# Altium project 48FE+2GE+2SFP.PrjPcb (part 7 of 9)

## Sheet 30_PP0_PWR.SchDoc
size 419 x 296 mm; Author: Serbinov O.A.; CompanyName: ELSICOM; DrawnBy: Serbinov O.A.; Engineer: Serbinov O.A.; Organization: Elsicom; Address1: Kirova avenue, 58; Address2: Tomsk; Address3: Russia 634012; DocumentNumber: 31; SheetNumber: 31; SheetTotal: 44; ProjectName: 48_PORTS
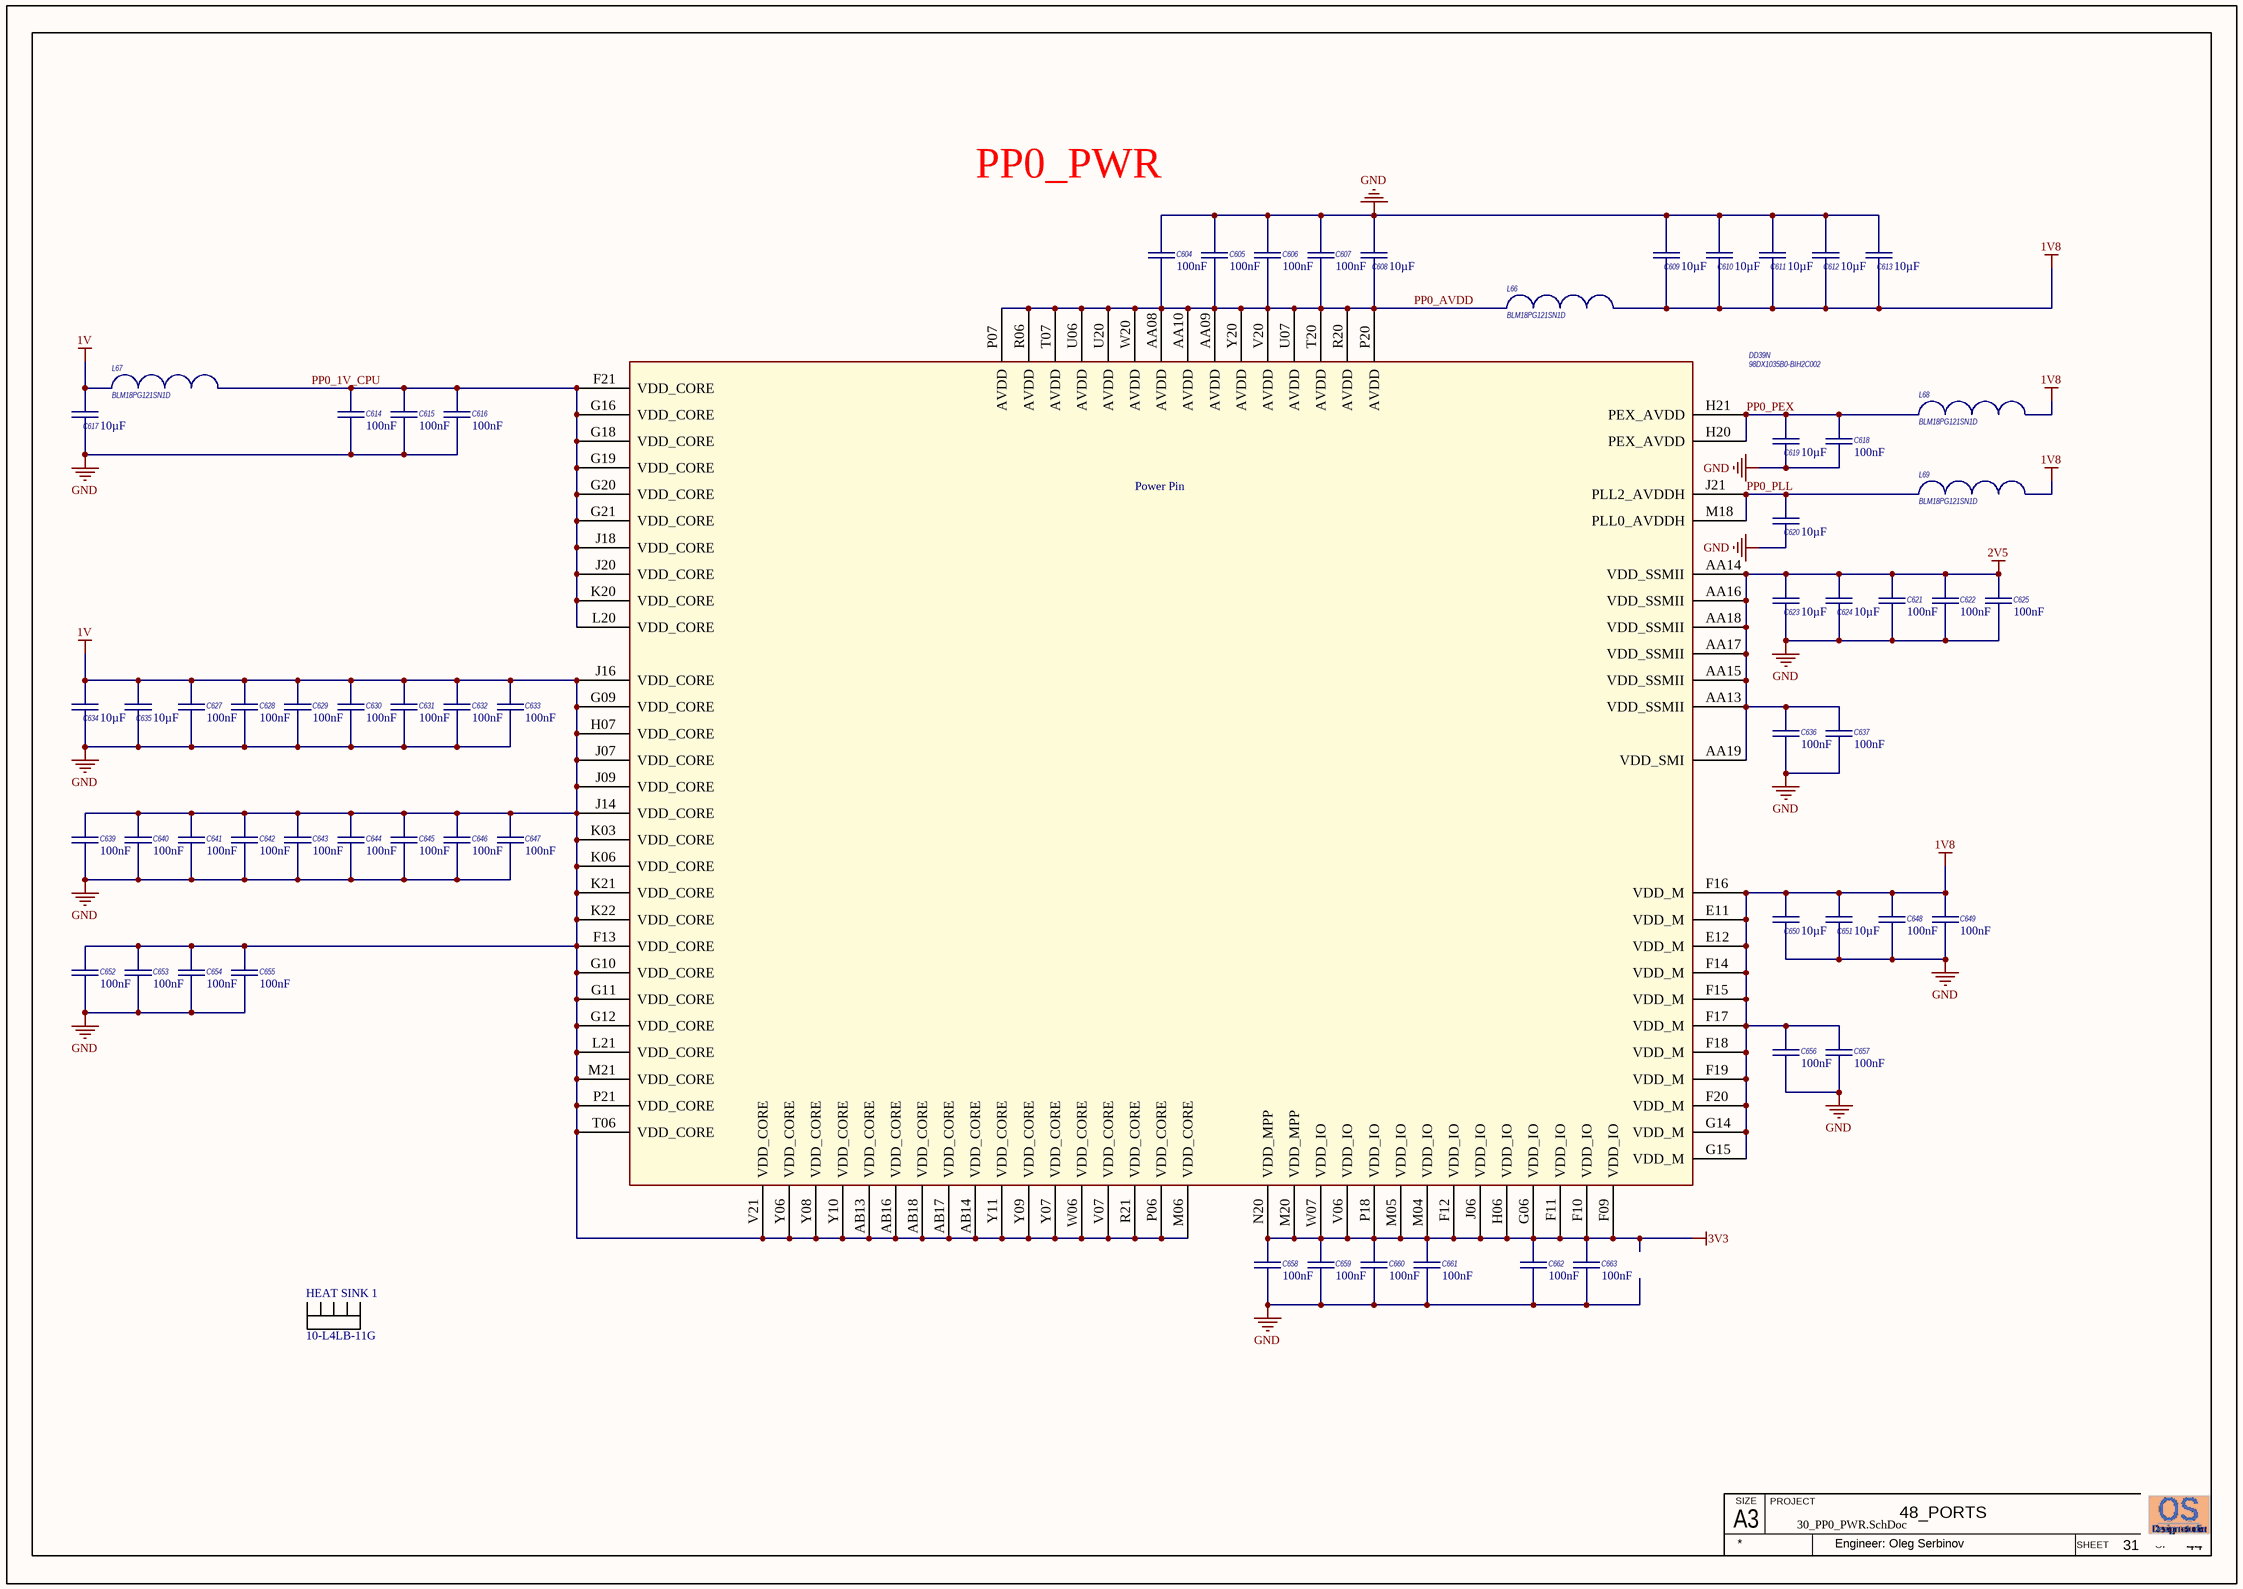
[diagram p17: 30_PP0_PWR.SchDoc]

### Parts
C604  Capacitance: 100nF  [C0402_IPC High Density]  (hidden comment: GRM155R71E104KE14D)
C605  Capacitance: 100nF  [C0402_IPC High Density]  (hidden comment: GRM155R71E104KE14D)
C606  Capacitance: 100nF  [C0402_IPC High Density]  (hidden comment: GRM155R71E104KE14D)
C607  Capacitance: 100nF  [C0402_IPC High Density]  (hidden comment: GRM155R71E104KE14D)
C608  Capacitance: 10µF  [CAPC2012[0805]]  (hidden comment: GRM21BR61C106KE15)
C609  Capacitance: 10µF  [CAPC2012[0805]]  (hidden comment: GRM21BR61C106KE15)
C610  Capacitance: 10µF  [CAPC2012[0805]]  (hidden comment: GRM21BR61C106KE15)
C611  Capacitance: 10µF  [CAPC2012[0805]]  (hidden comment: GRM21BR61C106KE15)
C612  Capacitance: 10µF  [CAPC2012[0805]]  (hidden comment: GRM21BR61C106KE15)
C613  Capacitance: 10µF  [CAPC2012[0805]]  (hidden comment: GRM21BR61C106KE15)
C614  Capacitance: 100nF  [C0402_IPC High Density]  (hidden comment: GRM155R71E104KE14D)
C615  Capacitance: 100nF  [C0402_IPC High Density]  (hidden comment: GRM155R71E104KE14D)
C616  Capacitance: 100nF  [C0402_IPC High Density]  (hidden comment: GRM155R71E104KE14D)
C617  Capacitance: 10µF  [CAPC2012[0805]]  (hidden comment: GRM21BR61C106KE15)
C618  Capacitance: 100nF  [C0402_IPC High Density]  (hidden comment: GRM155R71E104KE14D)
C619  Capacitance: 10µF  [CAPC2012[0805]]  (hidden comment: GRM21BR61C106KE15)
C620  Capacitance: 10µF  [CAPC2012[0805]]  (hidden comment: GRM21BR61C106KE15)
C621  Capacitance: 100nF  [C0402_IPC High Density]  (hidden comment: GRM155R71E104KE14D)
C622  Capacitance: 100nF  [C0402_IPC High Density]  (hidden comment: GRM155R71E104KE14D)
C623  Capacitance: 10µF  [CAPC2012[0805]]  (hidden comment: GRM21BR61C106KE15)
C624  Capacitance: 10µF  [CAPC2012[0805]]  (hidden comment: GRM21BR61C106KE15)
C625  Capacitance: 100nF  [C0402_IPC High Density]  (hidden comment: GRM155R71E104KE14D)
C627  Capacitance: 100nF  [C0402_IPC High Density]  (hidden comment: GRM155R71E104KE14D)
C628  Capacitance: 100nF  [C0402_IPC High Density]  (hidden comment: GRM155R71E104KE14D)
C629  Capacitance: 100nF  [C0402_IPC High Density]  (hidden comment: GRM155R71E104KE14D)
C630  Capacitance: 100nF  [C0402_IPC High Density]  (hidden comment: GRM155R71E104KE14D)
C631  Capacitance: 100nF  [C0402_IPC High Density]  (hidden comment: GRM155R71E104KE14D)
C632  Capacitance: 100nF  [C0402_IPC High Density]  (hidden comment: GRM155R71E104KE14D)
C633  Capacitance: 100nF  [C0402_IPC High Density]  (hidden comment: GRM155R71E104KE14D)
C634  Capacitance: 10µF  [CAPC2012[0805]]  (hidden comment: GRM21BR61C106KE15)
C635  Capacitance: 10µF  [CAPC2012[0805]]  (hidden comment: GRM21BR61C106KE15)
C636  Capacitance: 100nF  [C0402_IPC High Density]  (hidden comment: GRM155R71E104KE14D)
C637  Capacitance: 100nF  [C0402_IPC High Density]  (hidden comment: GRM155R71E104KE14D)
C639  Capacitance: 100nF  [C0402_IPC High Density]  (hidden comment: GRM155R71E104KE14D)
C640  Capacitance: 100nF  [C0402_IPC High Density]  (hidden comment: GRM155R71E104KE14D)
C641  Capacitance: 100nF  [C0402_IPC High Density]  (hidden comment: GRM155R71E104KE14D)
C642  Capacitance: 100nF  [C0402_IPC High Density]  (hidden comment: GRM155R71E104KE14D)
C643  Capacitance: 100nF  [C0402_IPC High Density]  (hidden comment: GRM155R71E104KE14D)
C644  Capacitance: 100nF  [C0402_IPC High Density]  (hidden comment: GRM155R71E104KE14D)
C645  Capacitance: 100nF  [C0402_IPC High Density]  (hidden comment: GRM155R71E104KE14D)
C646  Capacitance: 100nF  [C0402_IPC High Density]  (hidden comment: GRM155R71E104KE14D)
C647  Capacitance: 100nF  [C0402_IPC High Density]  (hidden comment: GRM155R71E104KE14D)
C648  Capacitance: 100nF  [C0402_IPC High Density]  (hidden comment: GRM155R71E104KE14D)
C649  Capacitance: 100nF  [C0402_IPC High Density]  (hidden comment: GRM155R71E104KE14D)
C650  Capacitance: 10µF  [CAPC2012[0805]]  (hidden comment: GRM21BR61C106KE15)
C651  Capacitance: 10µF  [CAPC2012[0805]]  (hidden comment: GRM21BR61C106KE15)
C652  Capacitance: 100nF  [C0402_IPC High Density]  (hidden comment: GRM155R71E104KE14D)
C653  Capacitance: 100nF  [C0402_IPC High Density]  (hidden comment: GRM155R71E104KE14D)
C654  Capacitance: 100nF  [C0402_IPC High Density]  (hidden comment: GRM155R71E104KE14D)
C655  Capacitance: 100nF  [C0402_IPC High Density]  (hidden comment: GRM155R71E104KE14D)
C656  Capacitance: 100nF  [C0402_IPC High Density]  (hidden comment: GRM155R71E104KE14D)
C657  Capacitance: 100nF  [C0402_IPC High Density]  (hidden comment: GRM155R71E104KE14D)
C658  Capacitance: 100nF  [C0402_IPC High Density]  (hidden comment: GRM155R71E104KE14D)
C659  Capacitance: 100nF  [C0402_IPC High Density]  (hidden comment: GRM155R71E104KE14D)
C660  Capacitance: 100nF  [C0402_IPC High Density]  (hidden comment: GRM155R71E104KE14D)
C661  Capacitance: 100nF  [C0402_IPC High Density]  (hidden comment: GRM155R71E104KE14D)
C662  Capacitance: 100nF  [C0402_IPC High Density]  (hidden comment: GRM155R71E104KE14D)
C663  Capacitance: 100nF  [C0402_IPC High Density]  (hidden comment: GRM155R71E104KE14D)
DD39  98DX1035B0-BIH2C002  [HSBGA617_27X27_1MM]  (part N of 16)
HEAT_SINK_1  10-L4LB-11G  [10-L4LB-11G]  (no BOM)
L66  BLM18PG121SN1D  [INDC1608X95N]
L67  BLM18PG121SN1D  [INDC1608X95N]
L68  BLM18PG121SN1D  [INDC1608X95N]
L69  BLM18PG121SN1D  [INDC1608X95N]

### Nets
1V: C617.2 C627.1 C628.1 C629.1 C630.1 C631.1 C632.1 C633.1 C634.2 C635.2 C639.1 C640.1 C641.1 C642.1 C643.1 C644.1 C645.1 C646.1 C647.1 C652.1 C653.1 C654.1 C655.1 DD39.AB13(VDD_CORE) DD39.AB14(VDD_CORE) DD39.AB16(VDD_CORE) DD39.AB17(VDD_CORE) DD39.AB18(VDD_CORE) DD39.F13(VDD_CORE) DD39.G09(VDD_CORE) DD39.G10(VDD_CORE) DD39.G11(VDD_CORE) DD39.G12(VDD_CORE) DD39.H07(VDD_CORE) DD39.J07(VDD_CORE) DD39.J09(VDD_CORE) DD39.J14(VDD_CORE) DD39.J16(VDD_CORE) DD39.K03(VDD_CORE) DD39.K06(VDD_CORE) DD39.K21(VDD_CORE) DD39.K22(VDD_CORE) DD39.L21(VDD_CORE) DD39.M06(VDD_CORE) DD39.M21(VDD_CORE) DD39.P06(VDD_CORE) DD39.P21(VDD_CORE) DD39.R21(VDD_CORE) DD39.T06(VDD_CORE) DD39.V07(VDD_CORE) DD39.V21(VDD_CORE) DD39.W06(VDD_CORE) DD39.Y06(VDD_CORE) DD39.Y07(VDD_CORE) DD39.Y08(VDD_CORE) DD39.Y09(VDD_CORE) DD39.Y10(VDD_CORE) DD39.Y11(VDD_CORE) L67.1
1V8: C609.1 C610.1 C611.1 C612.1 C613.1 C648.1 C649.1 C650.2 C651.2 C656.1 C657.1 DD39.E11(VDD_M) DD39.E12(VDD_M) DD39.F14(VDD_M) DD39.F15(VDD_M) DD39.F16(VDD_M) DD39.F17(VDD_M) DD39.F18(VDD_M) DD39.F19(VDD_M) DD39.F20(VDD_M) DD39.G14(VDD_M) DD39.G15(VDD_M) L66.2 L68.2 L69.2
2V5: C621.1 C622.1 C623.2 C624.2 C625.1 C636.1 C637.1 DD39.AA13(VDD_SSMII) DD39.AA14(VDD_SSMII) DD39.AA15(VDD_SSMII) DD39.AA16(VDD_SSMII) DD39.AA17(VDD_SSMII) DD39.AA18(VDD_SSMII) DD39.AA19(VDD_SMI)
3V3: C658.1 C659.1 C660.1 C661.1 C662.1 C663.1 DD39.F09(VDD_IO) DD39.F10(VDD_IO) DD39.F11(VDD_IO) DD39.F12(VDD_IO) DD39.G06(VDD_IO) DD39.H06(VDD_IO) DD39.J06(VDD_IO) DD39.M04(VDD_IO) DD39.M05(VDD_IO) DD39.M20(VDD_MPP) DD39.N20(VDD_MPP) DD39.P18(VDD_IO) DD39.V06(VDD_IO) DD39.W07(VDD_IO)
GND: C604.1 C605.1 C606.1 C607.1 C608.2 C609.2 C610.2 C611.2 C612.2 C613.2 C614.2 C615.2 C616.2 C617.1 C618.2 C619.1 C620.1 C621.2 C622.2 C623.1 C624.1 C625.2 C627.2 C628.2 C629.2 C630.2 C631.2 C632.2 C633.2 C634.1 C635.1 C636.2 C637.2 C639.2 C640.2 C641.2 C642.2 C643.2 C644.2 C645.2 C646.2 C647.2 C648.2 C649.2 C650.1 C651.1 C652.2 C653.2 C654.2 C655.2 C656.2 C657.2 C658.2 C659.2 C660.2 C661.2 C662.2 C663.2
PP0_1V_CPU: C614.1 C615.1 C616.1 DD39.F21(VDD_CORE) DD39.G16(VDD_CORE) DD39.G18(VDD_CORE) DD39.G19(VDD_CORE) DD39.G20(VDD_CORE) DD39.G21(VDD_CORE) DD39.J18(VDD_CORE) DD39.J20(VDD_CORE) DD39.K20(VDD_CORE) DD39.L20(VDD_CORE) L67.2
PP0_AVDD: C604.2 C605.2 C606.2 C607.2 C608.1 DD39.AA08(AVDD) DD39.AA09(AVDD) DD39.AA10(AVDD) DD39.P07(AVDD) DD39.P20(AVDD) DD39.R06(AVDD) DD39.R20(AVDD) DD39.T07(AVDD) DD39.T20(AVDD) DD39.U06(AVDD) DD39.U07(AVDD) DD39.U20(AVDD) DD39.V20(AVDD) DD39.W20(AVDD) DD39.Y20(AVDD) L66.1
PP0_PEX: C618.1 C619.2 DD39.H20(PEX_AVDD) DD39.H21(PEX_AVDD) L68.1
PP0_PLL: C620.2 DD39.J21(PLL2_AVDDH) DD39.M18(PLL0_AVDDH) L69.1

### Notes on the sheet
- PP0_PWR
- A3
- SIZE
- PROJECT
- SHEET
- OF
- Engineer: Oleg Serbinov
- (in symbol 98DX1035A1-BIH2C002, part N) Power Pin

### Library data of the parts
C604-C607 C614-C616 C618 C621 C622 C625 C627-C633 C636 C637 C639-C649 C652-C663 = GRM155R71E104KE14D: C0402, 100nF, 25V, X7R; Manufacturer: Murata; Rmanufacturer: Yageo  Samsung  TDK  Taiyo Yuden  Kemet; Customer Part Number: Конденсатор, 100n, 0402, 25V, X7R, 10%; Capacitance Tolerance: ± 10%; Voltage Rating: 16; Capacitor Case Style: 0402 [1005 Metric]; Capacitor Terminals: SMD; SVHC: No SVHC (19-Dec-2012); No. of Pins: 2; Reel Quantity: 10000; Tolerance +: 10%; Analogs: any suitable; Manufacturer Part Number: GRM155R71E104KE14D; RoHS: YES; Packaging: Reel; Package / Case: 0402; ComponentLink1URL: http://www.farnell.com/datasheets/4360.pdf; ComponentLink1Description: http://www.farnell.com/datasheets/4360.pdf; Pricing: 10000=0.008593, 30000=0.007991 (GBP); Supplier 1: Farnell; Supplier Part Number 1: 1118151; Stock: 3; Dielectric Characteristic: X7R; Operating Temperature Min: -55; Operating Temperature Max: 125; Operating Temperature Range: -55°C to +125; Series: GRM Hi-Cap; Terminal Type: Surface Mount (SMD, SMT); Tolerance -: 10%; Voltage Rating V DC: 16
C608-C613 C617 C619 C620 C623 C624 C634 C635 C650 C651 = GRM21BR61C106KE15: C0805, 10uF 10%, 16V, X5R; Manufacturer: Murata; Customer Part Number: Конденсатор, 10u, 0805, 16V, X5R, 10%; Analogs: any suitable; Applications: General Purpose; Category: Capacitors; Operating Temperature: -55°C ~ 85°C; Package / Case: 0805 (2012 Metric); Size / Dimension: 0.079" L x 0.049" W (2.00mm x 1.25mm); Temperature Coefficient: X5R; Tolerance: ±10%; ComponentLink1URL: http://search.murata.co.jp/Ceramy/image/img/PDF/ENG/GRM21BR61C106KE15.pdf; ComponentLink1Description: http://search.murata.co.jp/Ceramy/image/img/PDF/ENG/GRM21BR61C106KE15.pdf; Pricing: 1=0.3, 10=0.25, 50=0.1408, 100=0.1252, 250=0.09392, 500=0.08294, 1000=0.07356 (USD); Voltage - Rated: 16V; Manufacturer Part Number: GRM21BR61C106KE15
DD39 = 98DX1035A1-BIH2C002: IC 24-PORT FE  4-PORT 2.5GE L2 ENTRY-LEVEL, CPU; Customer Part Number: Микросхема, 98DX1035B0-BIH2C002, IC 24-PORT FE 4-PORT 2.5GE L2 ENTRY-LEVEL, HSBGA617SBGA617; Manufacturer: Marvell Technology Group; Manufacturer Part Number: 98DX1035B0-BIH2C002
HEAT_SINK_1 = 10-L4LB-11G: HEAT SINK  45.2x41.4; Manufacturer: Aavid Thermalloy; Customer Part Number: Радиатор, 10-L4LB-11G, Pin Fin heat sink with Push Pin attachment; Manufacturer Part Number: 10-L4LB-11G
L66-L69 = BLM18PG121SN1D: FILTER BLM18 (0603, 2A); Manufacturer: Murata; Rpart number: MPZ1608S121ATAH0 ; CIC10P121NC ; MPZ1608S121ATDH5 ; BLM18PG121SH1D ; 742792625; Rmanufacturer: Boruns  Samsung  TDK  Murata  Wurth Electronics; Customer Part Number: Дроссель, BLM18PG121SN1D, FERRITE BEAD 120 OHM 1LN, 0603; DC Resistance Max: 0.05; Impedance: 120; Ferrite Mounting: SMD; Inductor Type: Ferrite Bead; SVHC: No SVHC (19-Dec-2011); Ferrite Case Style: 0603 / 1608; Core Material: Ferrite; DC Current Max: 2000; Inductor Case Style: 0603; Inductance Tolerance: ± 25%; No. of Pins: 2; RoHS: YES; Operating Temperature Min: -55; Mounting Type: SMD; Operating Temperature Max: +125; Package / Case: 0603; Impedance @ 100MHz Typ: 120; Resistance: 0.05; Supplier Part Number: 1515738; Supplier: Farnell; ComponentLink1URL: http://www.farnell.com/datasheets/5148.pdf; ComponentLink1Description: http://www.farnell.com/datasheets/5148.pdf; Pricing: 5=0.056, 50=0.041, 100=0.034, 250=0.028, 500=0.027 (GBP); Manufacturer Part Number: BLM18PG121SN1D; DC Current Rating: 2A; Analogs: MPZ1608S121ATAH0 ; CIC10P121NC ; MPZ1608S121ATDH5 ; BLM18PG121SH1D ; 742792625

## Sheet 32_PP0_NC.SchDoc
size 419 x 296 mm; Author: Serbinov O.A.; CompanyName: ELSICOM; DrawnBy: Serbinov O.A.; Engineer: Serbinov O.A.; Organization: Elsicom; Address1: Kirova avenue, 58; Address2: Tomsk; Address3: Russia 634012; DocumentNumber: 33; SheetNumber: 33; SheetTotal: 44; ProjectName: 48_PORTS
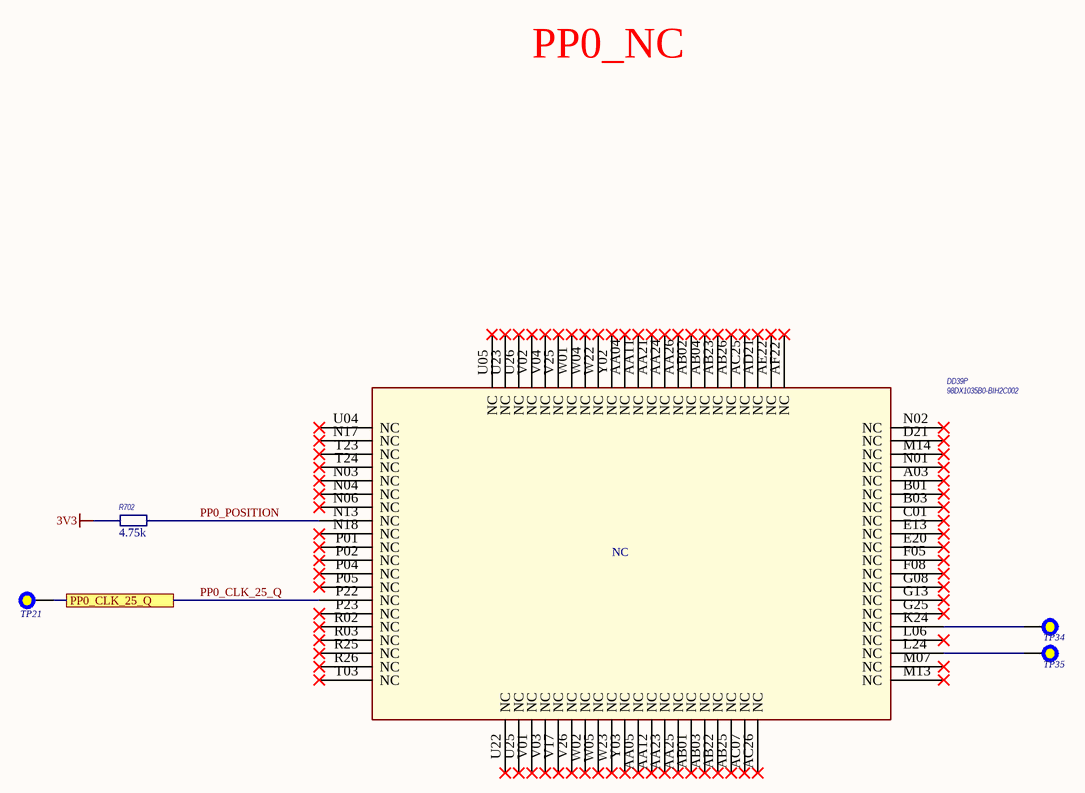
[diagram p18: 32_PP0_NC.SchDoc]

### Parts
DD39  98DX1035B0-BIH2C002  [HSBGA617_27X27_1MM]  (part P of 16)
R702  Resistance (Ohms): 4.75k  [R0402_IPC High Density]  (hidden comment: ERJ-2RKF4751X)
TP21  Test Point 0.5mm pad  [Test Point 0.5mm]  (value not drawn)  (no BOM)
TP34  Test Point 0.5mm pad  [Test Point 0.5mm]  (value not drawn)  (no BOM)
TP35  Test Point 0.5mm pad  [Test Point 0.5mm]  (value not drawn)  (no BOM)

### Ports
PP0_CLK_25_Q

### Nets
3V3: R702.1
PP0_CLK_25_Q: DD39.P22(NC) TP21.1 ; port PP0_CLK_25_Q
PP0_POSITION: DD39.N13(NC) R702.2
NetDD39_K24: DD39.K24(NC) TP34.1
NetDD39_L24: DD39.L24(NC) TP35.1

Not connected (* = marked no-connect by the designer): DD39 A03(NC)* AA04(NC)* AA05(NC)* AA11(NC)* AA12(NC)* AA21(NC)* AA23(NC)* AA24(NC)* AA25(NC)* AA26(NC)* AB01(NC)* AB02(NC)* AB03(NC)* AB04(NC)* AB22(NC)* AB23(NC)* AB25(NC)* AB26(NC)* AC07(NC)* AC25(NC)* AC26(NC)* AD21(NC)* AE22(NC)* AF22(NC)* B01(NC)* B03(NC)* C01(NC)* D21(NC)* E13(NC)* E20(NC)* F05(NC)* F08(NC)* G08(NC)* G13(NC)* G25(NC)* L06(NC)* M07(NC)* M13(NC)* M14(NC)* N01(NC)* N02(NC)* N03(NC)* N04(NC)* N06(NC)* N17(NC)* N18(NC)* P01(NC)* P02(NC)* P04(NC)* P05(NC)* P23(NC)* R02(NC)* R03(NC)* R25(NC)* R26(NC)* T03(NC)* T23(NC)* T24(NC)* U04(NC)* U05(NC)* U22(NC)* U23(NC)* U25(NC)* U26(NC)* V01(NC)* V02(NC)* V03(NC)* V04(NC)* V17(NC)* V25(NC)* V26(NC)* W01(NC)* W02(NC)* W04(NC)* W05(NC)* W22(NC)* W23(NC)* Y02(NC)* Y03(NC)*

### Notes on the sheet
- PP0_NC
- A3
- SIZE
- PROJECT
- SHEET
- OF
- Engineer: Oleg Serbinov

### Library data of the parts
DD39 = 98DX1035A1-BIH2C002: as DD39 on sheet 30_PP0_PWR; Manufacturer Part Number: 98DX1035B0-BIH2C002
R702 = ERJ-2RKF4751X: R0402, 4.75k 1%; Manufacturer: Panasonic; Rpart number: RC0402FR-074K75L ; RC1005F4751CS ; RMCF0402FT4K75 ; CRCW04024K75FKED ; TRR01MZPF4751; Rmanufacturer: Yageo  Samsung  Stackpole Electronics  Rohm Semiconductor  Vishay Dale; Customer Part Number: Резистор, 4K75, 0402, 1%; Temperature Coefficient: ±100ppm/°C; Power (Watts): 0.1W, 1/10W; Analogs: any suitable; Tolerance: ±1%; Packaging: Cut Tape (CT); Package / Case: 0402 (1005 Metric); Category: Resistors; Manufacturer Part Number: ERJ-2RKF4751X; Supplier Part Number: P4.75KLCT-ND; RoHS: RoHS Compliant; Supplier: Digi-Key; ComponentLink1URL: http://industrial.panasonic.com/www-cgi/jvcr13pz.cgi?E+PZ+3+AOA0002+ERJ2RKF4751X+7+WW; ComponentLink1Description: http://industrial.panasonic.com/www-cgi/jvcr13pz.cgi?E+PZ+3+AOA0002+ERJ2RKF4751X+7+WW; Features: -; Composition: Thick Film; Height: 0.016" (0.40mm); Number of Terminations: 2; Supplier Device Package: 0402; Size / Dimension: 0.039" L x 0.020" W (1.00mm x 0.50mm)

## Sheet 33_PP0_CONFIG.SchDoc
size 419 x 296 mm; Author: Serbinov O.A.; CompanyName: ELSICOM; DrawnBy: Serbinov O.A.; Engineer: Serbinov O.A.; Organization: Elsicom; Address1: Kirova avenue, 58; Address2: Tomsk; Address3: Russia 634012; DocumentNumber: 34; SheetNumber: 34; SheetTotal: 44; ProjectName: 48_PORTS
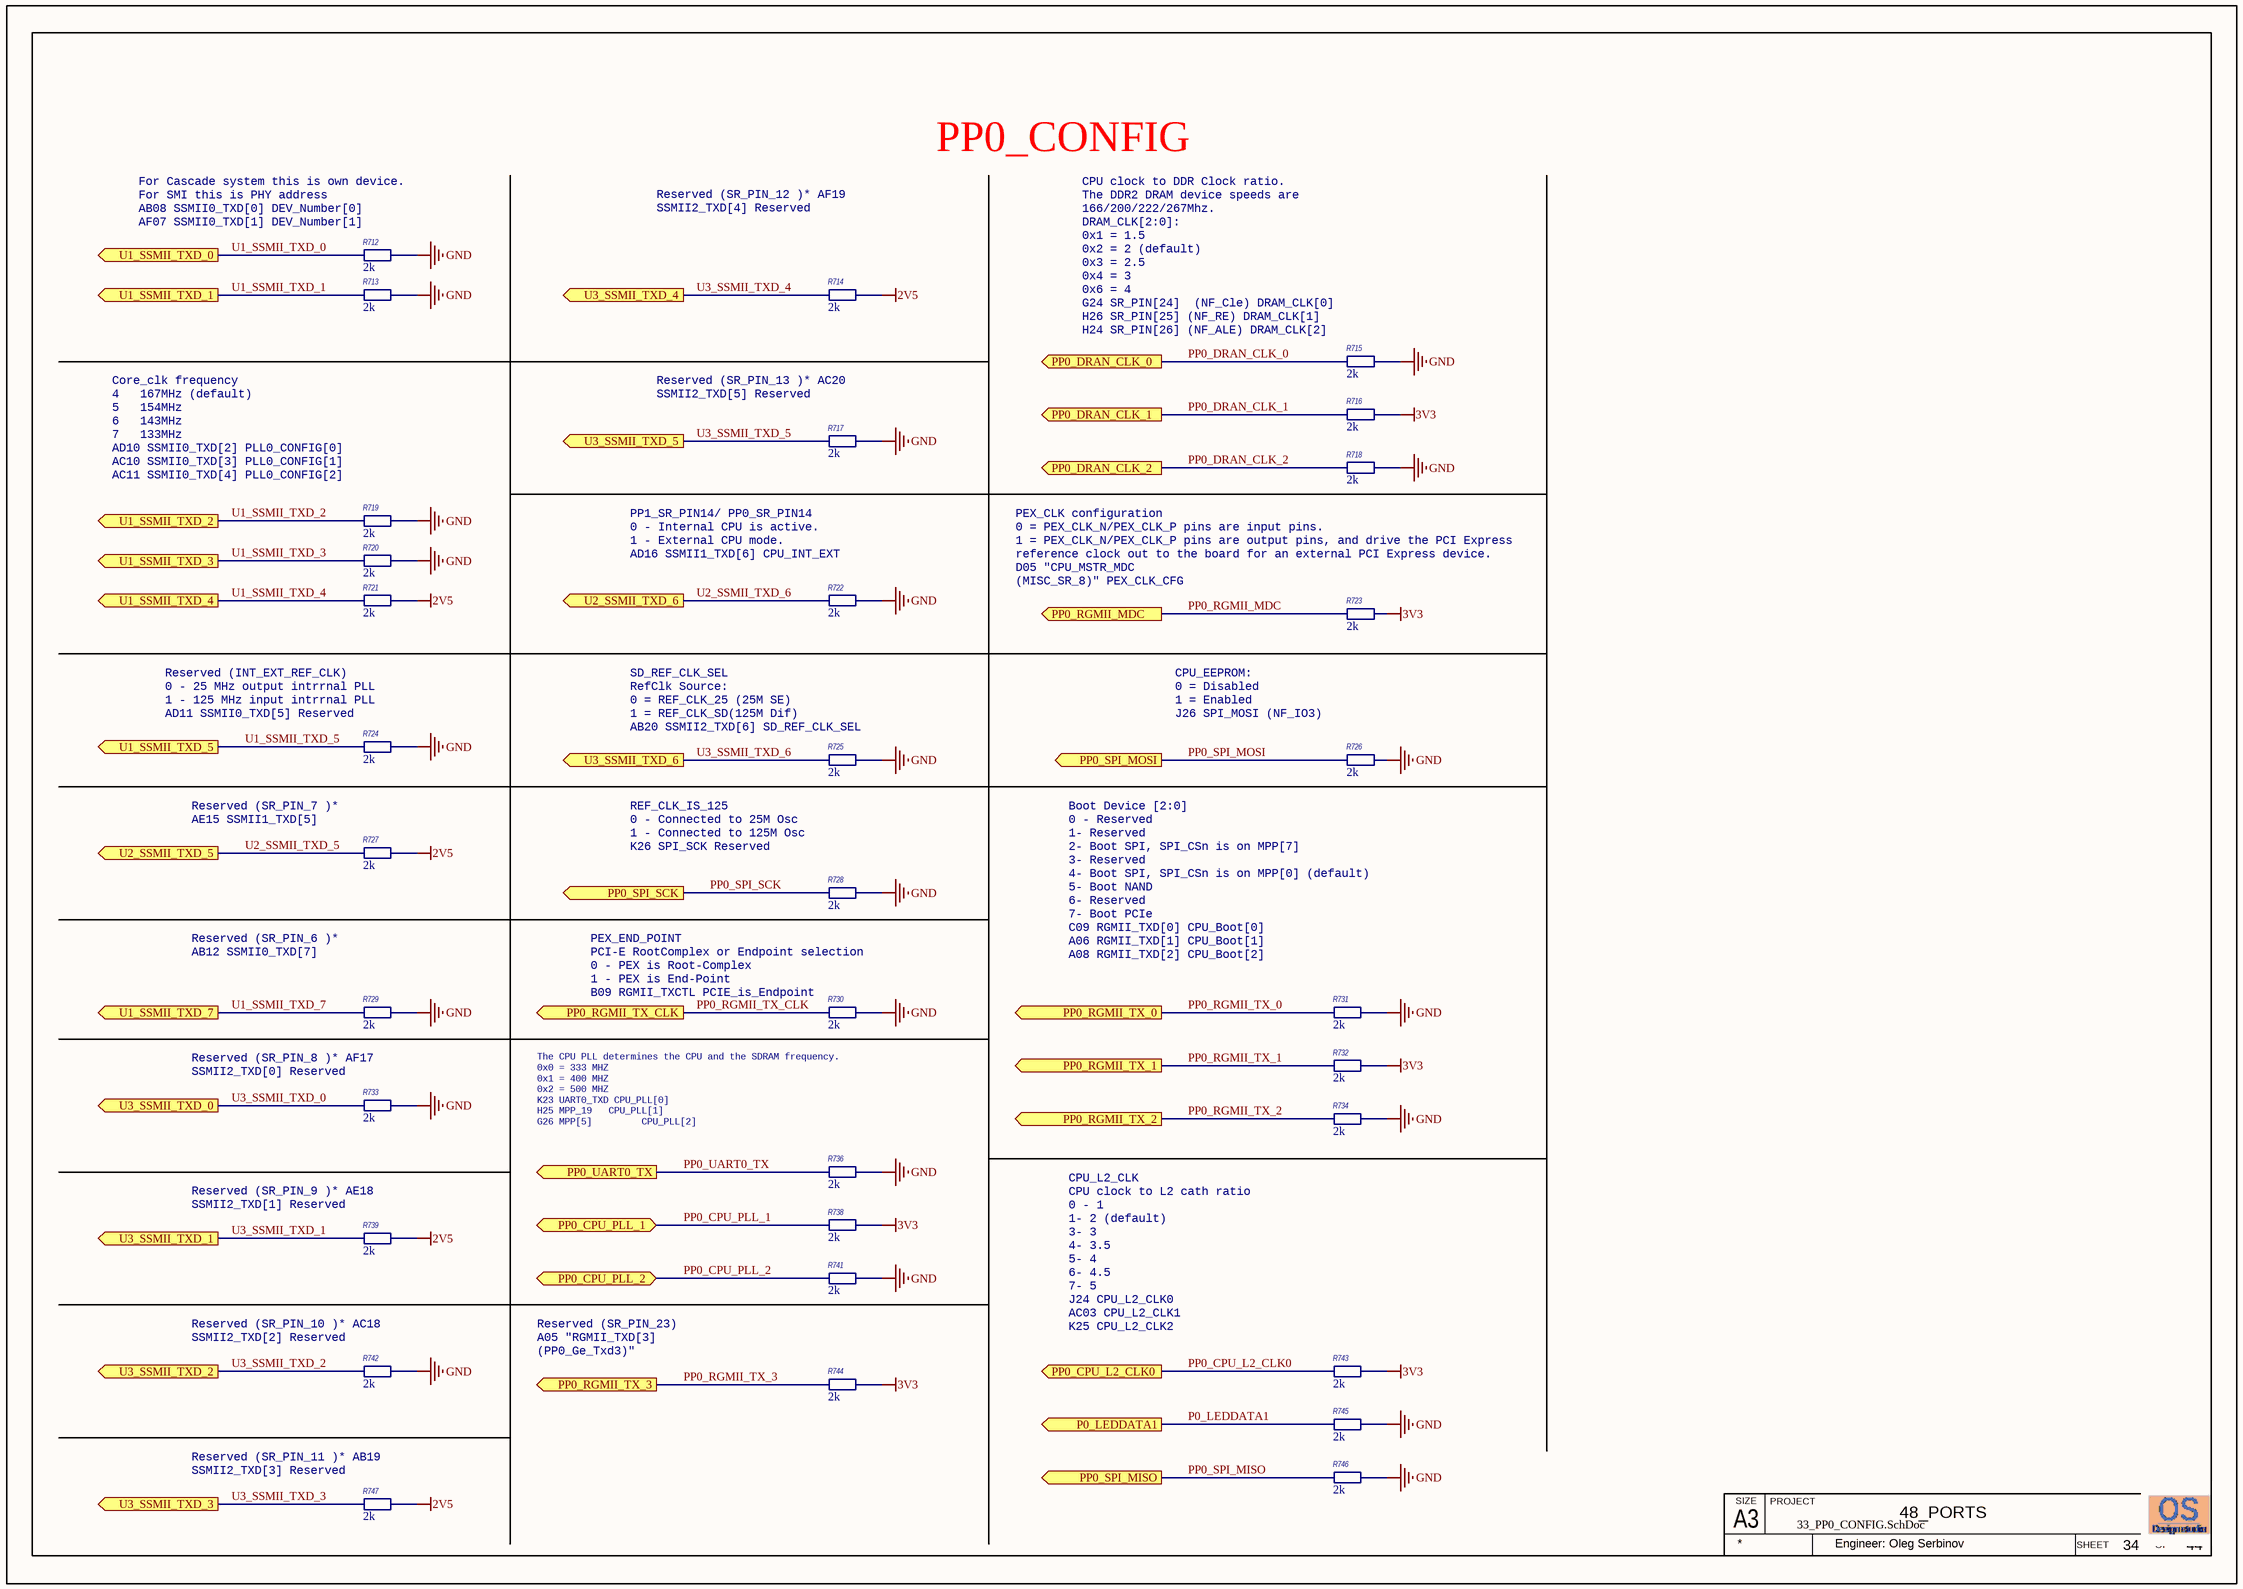
[diagram p19: 33_PP0_CONFIG.SchDoc]

### Parts
R712  Resistance (Ohms): 2k  [R0402_IPC High Density]  (hidden comment: ERJ-2RKF2001X)
R713  Resistance (Ohms): 2k  [R0402_IPC High Density]  (hidden comment: ERJ-2RKF2001X)
R714  Resistance (Ohms): 2k  [R0402_IPC High Density]  (hidden comment: ERJ-2RKF2001X)
R715  Resistance (Ohms): 2k  [R0402_IPC High Density]  (hidden comment: ERJ-2RKF2001X)
R716  Resistance (Ohms): 2k  [R0402_IPC High Density]  (hidden comment: ERJ-2RKF2001X)
R717  Resistance (Ohms): 2k  [R0402_IPC High Density]  (hidden comment: ERJ-2RKF2001X)
R718  Resistance (Ohms): 2k  [R0402_IPC High Density]  (hidden comment: ERJ-2RKF2001X)
R719  Resistance (Ohms): 2k  [R0402_IPC High Density]  (hidden comment: ERJ-2RKF2001X)
R720  Resistance (Ohms): 2k  [R0402_IPC High Density]  (hidden comment: ERJ-2RKF2001X)
R721  Resistance (Ohms): 2k  [R0402_IPC High Density]  (hidden comment: ERJ-2RKF2001X)
R722  Resistance (Ohms): 2k  [R0402_IPC High Density]  (hidden comment: ERJ-2RKF2001X)
R723  Resistance (Ohms): 2k  [R0402_IPC High Density]  (hidden comment: ERJ-2RKF2001X)
R724  Resistance (Ohms): 2k  [R0402_IPC High Density]  (hidden comment: ERJ-2RKF2001X)
R725  Resistance (Ohms): 2k  [R0402_IPC High Density]  (hidden comment: ERJ-2RKF2001X)
R726  Resistance (Ohms): 2k  [R0402_IPC High Density]  (hidden comment: ERJ-2RKF2001X)
R727  Resistance (Ohms): 2k  [R0402_IPC High Density]  (hidden comment: ERJ-2RKF2001X)
R728  Resistance (Ohms): 2k  [R0402_IPC High Density]  (hidden comment: ERJ-2RKF2001X)
R729  Resistance (Ohms): 2k  [R0402_IPC High Density]  (hidden comment: ERJ-2RKF2001X)
R730  Resistance (Ohms): 2k  [R0402_IPC High Density]  (hidden comment: ERJ-2RKF2001X)
R731  Resistance (Ohms): 2k  [R0402_IPC High Density]  (hidden comment: ERJ-2RKF2001X)
R732  Resistance (Ohms): 2k  [R0402_IPC High Density]  (hidden comment: ERJ-2RKF2001X)
R733  Resistance (Ohms): 2k  [R0402_IPC High Density]  (hidden comment: ERJ-2RKF2001X)
R734  Resistance (Ohms): 2k  [R0402_IPC High Density]  (hidden comment: ERJ-2RKF2001X)
R736  Resistance (Ohms): 2k  [R0402_IPC High Density]  (hidden comment: ERJ-2RKF2001X)
R738  Resistance (Ohms): 2k  [R0402_IPC High Density]  (hidden comment: ERJ-2RKF2001X)
R739  Resistance (Ohms): 2k  [R0402_IPC High Density]  (hidden comment: ERJ-2RKF2001X)
R741  Resistance (Ohms): 2k  [R0402_IPC High Density]  (hidden comment: ERJ-2RKF2001X)
R742  Resistance (Ohms): 2k  [R0402_IPC High Density]  (hidden comment: ERJ-2RKF2001X)
R743  Resistance (Ohms): 2k  [R0402_IPC High Density]  (hidden comment: ERJ-2RKF2001X)
R744  Resistance (Ohms): 2k  [R0402_IPC High Density]  (hidden comment: ERJ-2RKF2001X)
R745  Resistance (Ohms): 2k  [R0402_IPC High Density]  (hidden comment: ERJ-2RKF2001X)
R746  Resistance (Ohms): 2k  [R0402_IPC High Density]  (hidden comment: ERJ-2RKF2001X)
R747  Resistance (Ohms): 2k  [R0402_IPC High Density]  (hidden comment: ERJ-2RKF2001X)

### Ports
P0_LEDDATA1 (out), PP0_CPU_L2_CLK0 (out), PP0_CPU_PLL_1 (bidir), PP0_CPU_PLL_2 (bidir), PP0_DRAN_CLK_0 (out), PP0_DRAN_CLK_1 (out), PP0_DRAN_CLK_2 (out), PP0_RGMII_MDC (out), PP0_RGMII_TX_0 (out), PP0_RGMII_TX_1 (out), PP0_RGMII_TX_2 (out), PP0_RGMII_TX_3 (out), PP0_RGMII_TX_CLK (out), PP0_SPI_MISO (out), PP0_SPI_MOSI (out), PP0_SPI_SCK (out), PP0_UART0_TX (out), U1_SSMII_TXD_0 (out), U1_SSMII_TXD_1 (out), U1_SSMII_TXD_2 (out), U1_SSMII_TXD_3 (out), U1_SSMII_TXD_4 (out), U1_SSMII_TXD_5 (out), U1_SSMII_TXD_7 (out), U2_SSMII_TXD_5 (out), U2_SSMII_TXD_6 (out), U3_SSMII_TXD_0 (out), U3_SSMII_TXD_1 (out), U3_SSMII_TXD_2 (out), U3_SSMII_TXD_3 (out), U3_SSMII_TXD_4 (out), U3_SSMII_TXD_5 (out), U3_SSMII_TXD_6 (out)

### Nets
2V5: R714.2 R721.2 R727.2 R739.2 R747.2
3V3: R716.2 R723.2 R732.2 R738.2 R743.2 R744.2
GND: R712.2 R713.2 R715.2 R717.2 R718.2 R719.2 R720.2 R722.2 R724.2 R725.2 R726.2 R728.2 R729.2 R730.2 R731.2 R733.2 R734.2 R736.2 R741.2 R742.2 R745.2 R746.2
P0_LEDDATA1: R745.1 ; port P0_LEDDATA1
PP0_CPU_L2_CLK0: R743.1 ; port PP0_CPU_L2_CLK0
PP0_CPU_PLL_1: R738.1 ; port PP0_CPU_PLL_1
PP0_CPU_PLL_2: R741.1 ; port PP0_CPU_PLL_2
PP0_DRAN_CLK_0: R715.1 ; port PP0_DRAN_CLK_0
PP0_DRAN_CLK_1: R716.1 ; port PP0_DRAN_CLK_1
PP0_DRAN_CLK_2: R718.1 ; port PP0_DRAN_CLK_2
PP0_RGMII_MDC: R723.1 ; port PP0_RGMII_MDC
PP0_RGMII_TX_0: R731.1 ; port PP0_RGMII_TX_0
PP0_RGMII_TX_1: R732.1 ; port PP0_RGMII_TX_1
PP0_RGMII_TX_2: R734.1 ; port PP0_RGMII_TX_2
PP0_RGMII_TX_3: R744.1 ; port PP0_RGMII_TX_3
PP0_RGMII_TX_CLK: R730.1 ; port PP0_RGMII_TX_CLK
PP0_SPI_MISO: R746.1 ; port PP0_SPI_MISO
PP0_SPI_MOSI: R726.1 ; port PP0_SPI_MOSI
PP0_SPI_SCK: R728.1 ; port PP0_SPI_SCK
PP0_UART0_TX: R736.1 ; port PP0_UART0_TX
U1_SSMII_TXD_0: R712.1 ; port U1_SSMII_TXD_0
U1_SSMII_TXD_1: R713.1 ; port U1_SSMII_TXD_1
U1_SSMII_TXD_2: R719.1 ; port U1_SSMII_TXD_2
U1_SSMII_TXD_3: R720.1 ; port U1_SSMII_TXD_3
U1_SSMII_TXD_4: R721.1 ; port U1_SSMII_TXD_4
U1_SSMII_TXD_5: R724.1 ; port U1_SSMII_TXD_5
U1_SSMII_TXD_7: R729.1 ; port U1_SSMII_TXD_7
U2_SSMII_TXD_5: R727.1 ; port U2_SSMII_TXD_5
U2_SSMII_TXD_6: R722.1 ; port U2_SSMII_TXD_6
U3_SSMII_TXD_0: R733.1 ; port U3_SSMII_TXD_0
U3_SSMII_TXD_1: R739.1 ; port U3_SSMII_TXD_1
U3_SSMII_TXD_2: R742.1 ; port U3_SSMII_TXD_2
U3_SSMII_TXD_3: R747.1 ; port U3_SSMII_TXD_3
U3_SSMII_TXD_4: R714.1 ; port U3_SSMII_TXD_4
U3_SSMII_TXD_5: R717.1 ; port U3_SSMII_TXD_5
U3_SSMII_TXD_6: R725.1 ; port U3_SSMII_TXD_6

### Notes on the sheet
- PP0_CONFIG
- (near R712) For Cascade system this is own device.
  For SMI this is PHY address
  AB08	SSMII0_TXD[0]	DEV_Number[0]
  AF07	SSMII0_TXD[1]	DEV_Number[1]
- Reserved (SR_PIN_12 )*	AF19
  SSMII2_TXD[4]	Reserved
- (near R715) CPU clock to DDR Clock ratio.
  The DDR2 DRAM device speeds are 166/200/222/267Mhz.
  DRAM_CLK[2:0]:
  0x1 = 1.5
  0x2 = 2 (default)
  0x3 = 2.5
  0x4 = 3
  0x6 = 4
  G24	SR_PIN[24]  (NF_Cle)	DRAM_CLK[0]
  H26	SR_PIN[25] (NF_RE)	DRAM_CLK[1]
  H24	SR_PIN[26] (NF_ALE)	DRAM_CLK[2]
- (near R717) Reserved (SR_PIN_13 )*	AC20
  SSMII2_TXD[5]	Reserved
- (near R719) Core_clk frequency
  4   167MHz (default)
  5   154MHz
  6   143MHz
  7   133MHz
  AD10	SSMII0_TXD[2]	PLL0_CONFIG[0]
  AC10	SSMII0_TXD[3]	PLL0_CONFIG[1]
  AC11	SSMII0_TXD[4]	PLL0_CONFIG[2]
- (near R722) PP1_SR_PIN14/ PP0_SR_PIN14
  0 - Internal CPU is active.
  1 - External CPU mode.
  AD16	SSMII1_TXD[6]	CPU_INT_EXT
- PEX_CLK configuration
  0 = PEX_CLK_N/PEX_CLK_P pins are input pins.
  1 = PEX_CLK_N/PEX_CLK_P pins are output pins, and drive the PCI Express reference clock out to the board for an external PCI Express device.
  D05	"CPU_MSTR_MDC
  (MISC_SR_8)"	PEX_CLK_CFG
- (near R724) Reserved (INT_EXT_REF_CLK)
  0 - 25 MHz output intrrnal PLL
  1 - 125 MHz input intrrnal PLL
  AD11	SSMII0_TXD[5]	Reserved
- (near R725) SD_REF_CLK_SEL
  RefClk Source:
  0 = REF_CLK_25 (25M SE)
  1 = REF_CLK_SD(125M Dif)
  AB20	SSMII2_TXD[6]	SD_REF_CLK_SEL
- CPU_EEPROM:
  0 = Disabled
  1 = Enabled
  J26	SPI_MOSI (NF_IO3)	CPU_EEPROM_EN
- (near R727) Reserved (SR_PIN_7 )*
  AE15	SSMII1_TXD[5]
- REF_CLK_IS_125
  0 - Connected to 25M Osc
  1 - Connected to 125M Osc
  K26	SPI_SCK	Reserved
- (near R729) Reserved (SR_PIN_6 )*
  AB12	SSMII0_TXD[7]
- Boot Device [2:0]
  0 - Reserved
  1- Reserved
  2- Boot SPI, SPI_CSn is on MPP[7]
  3- Reserved
  4- Boot SPI, SPI_CSn is on MPP[0] (default)
  5- Boot NAND
  6- Reserved
  7- Boot PCIe
  C09	RGMII_TXD[0]	CPU_Boot[0]
  A06	RGMII_TXD[1]	CPU_Boot[1]
  A08	RGMII_TXD[2]	CPU_Boot[2]
- (near R730) PEX_END_POINT
  PCI-E RootComplex or Endpoint selection
  0 - PEX is Root-Complex
  1 - PEX is End-Point
  B09	RGMII_TXCTL	PCIE_is_Endpoint
- (near R733) Reserved (SR_PIN_8 )*	AF17
  SSMII2_TXD[0]	Reserved
- The CPU PLL determines the CPU and the SDRAM frequency.
  0x0 = 333 MHZ
  0x1 = 400 MHZ
  0x2 = 500 MHZ
  K23	UART0_TXD	CPU_PLL[0]
  H25	MPP_19  	CPU_PLL[1]
  G26	MPP[5]	        CPU_PLL[2]
- (near R739) Reserved (SR_PIN_9 )*	AE18
  SSMII2_TXD[1]	Reserved
- CPU_L2_CLK
  CPU clock to L2 cath ratio
  0 - 1
  1- 2 (default)
  3- 3
  4- 3.5
  5- 4
  6- 4.5
  7- 5
  J24	CPU_L2_CLK0
  AC03	CPU_L2_CLK1
  K25	CPU_L2_CLK2
- (near R742) Reserved (SR_PIN_10 )*	AC18
  SSMII2_TXD[2]	Reserved
- (near R744) Reserved (SR_PIN_23)
  A05	"RGMII_TXD[3]
  (PP0_Ge_Txd3)"
- (near R747) Reserved (SR_PIN_11 )*	AB19
  SSMII2_TXD[3]	Reserved
- A3
- SIZE
- PROJECT
- SHEET
- OF
- Engineer: Oleg Serbinov

### Library data of the parts
R712-R734 R736 R738 R739 R741-R747 = ERJ-2RKF2001X: R0402, 2k 1%; Manufacturer: Panasonic; Customer Part Number: Резистор, 2K, 0402, 1%; Temperature Coefficient: ±100ppm/°C; Power (Watts): 0.1W, 1/10W; Analogs: any suitable; Tolerance: ±1%; Packaging: Tape & Reel (TR); Package / Case: 0402 (1005 Metric); Category: Resistors; Manufacturer Part Number: ERJ-2RKF2001X; Supplier Part Number: P2.00KLTR-ND; RoHS: RoHS Compliant; Supplier: Digi-Key; ComponentLink1URL: http://industrial.panasonic.com/www-cgi/jvcr13pz.cgi?E+PZ+3+AOA0002+ERJ2RKF2001X+7+WW; ComponentLink1Description: http://industrial.panasonic.com/www-cgi/jvcr13pz.cgi?E+PZ+3+AOA0002+ERJ2RKF2001X+7+WW; Pricing: 10000=0.00347, 30000=0.00305, 50000=0.00279, 100000=0.00274 (USD); Features: -; Height: 0.016" (0.40mm); Size / Dimension: 0.039" L x 0.020" W (1.00mm x 0.50mm); Composition: Thick Film; Number of Terminations: 2

## Sheet 34_PP1_JTAG, PCIe.SchDoc
size 419 x 296 mm; Author: Serbinov O.A.; CompanyName: ELSICOM; DrawnBy: Serbinov O.A.; Engineer: Serbinov O.A.; Organization: Elsicom; Address1: Kirova avenue, 58; Address2: Tomsk; Address3: Russia 634012; DocumentNumber: 35; SheetNumber: 35; SheetTotal: 44; ProjectName: 48_PORTS
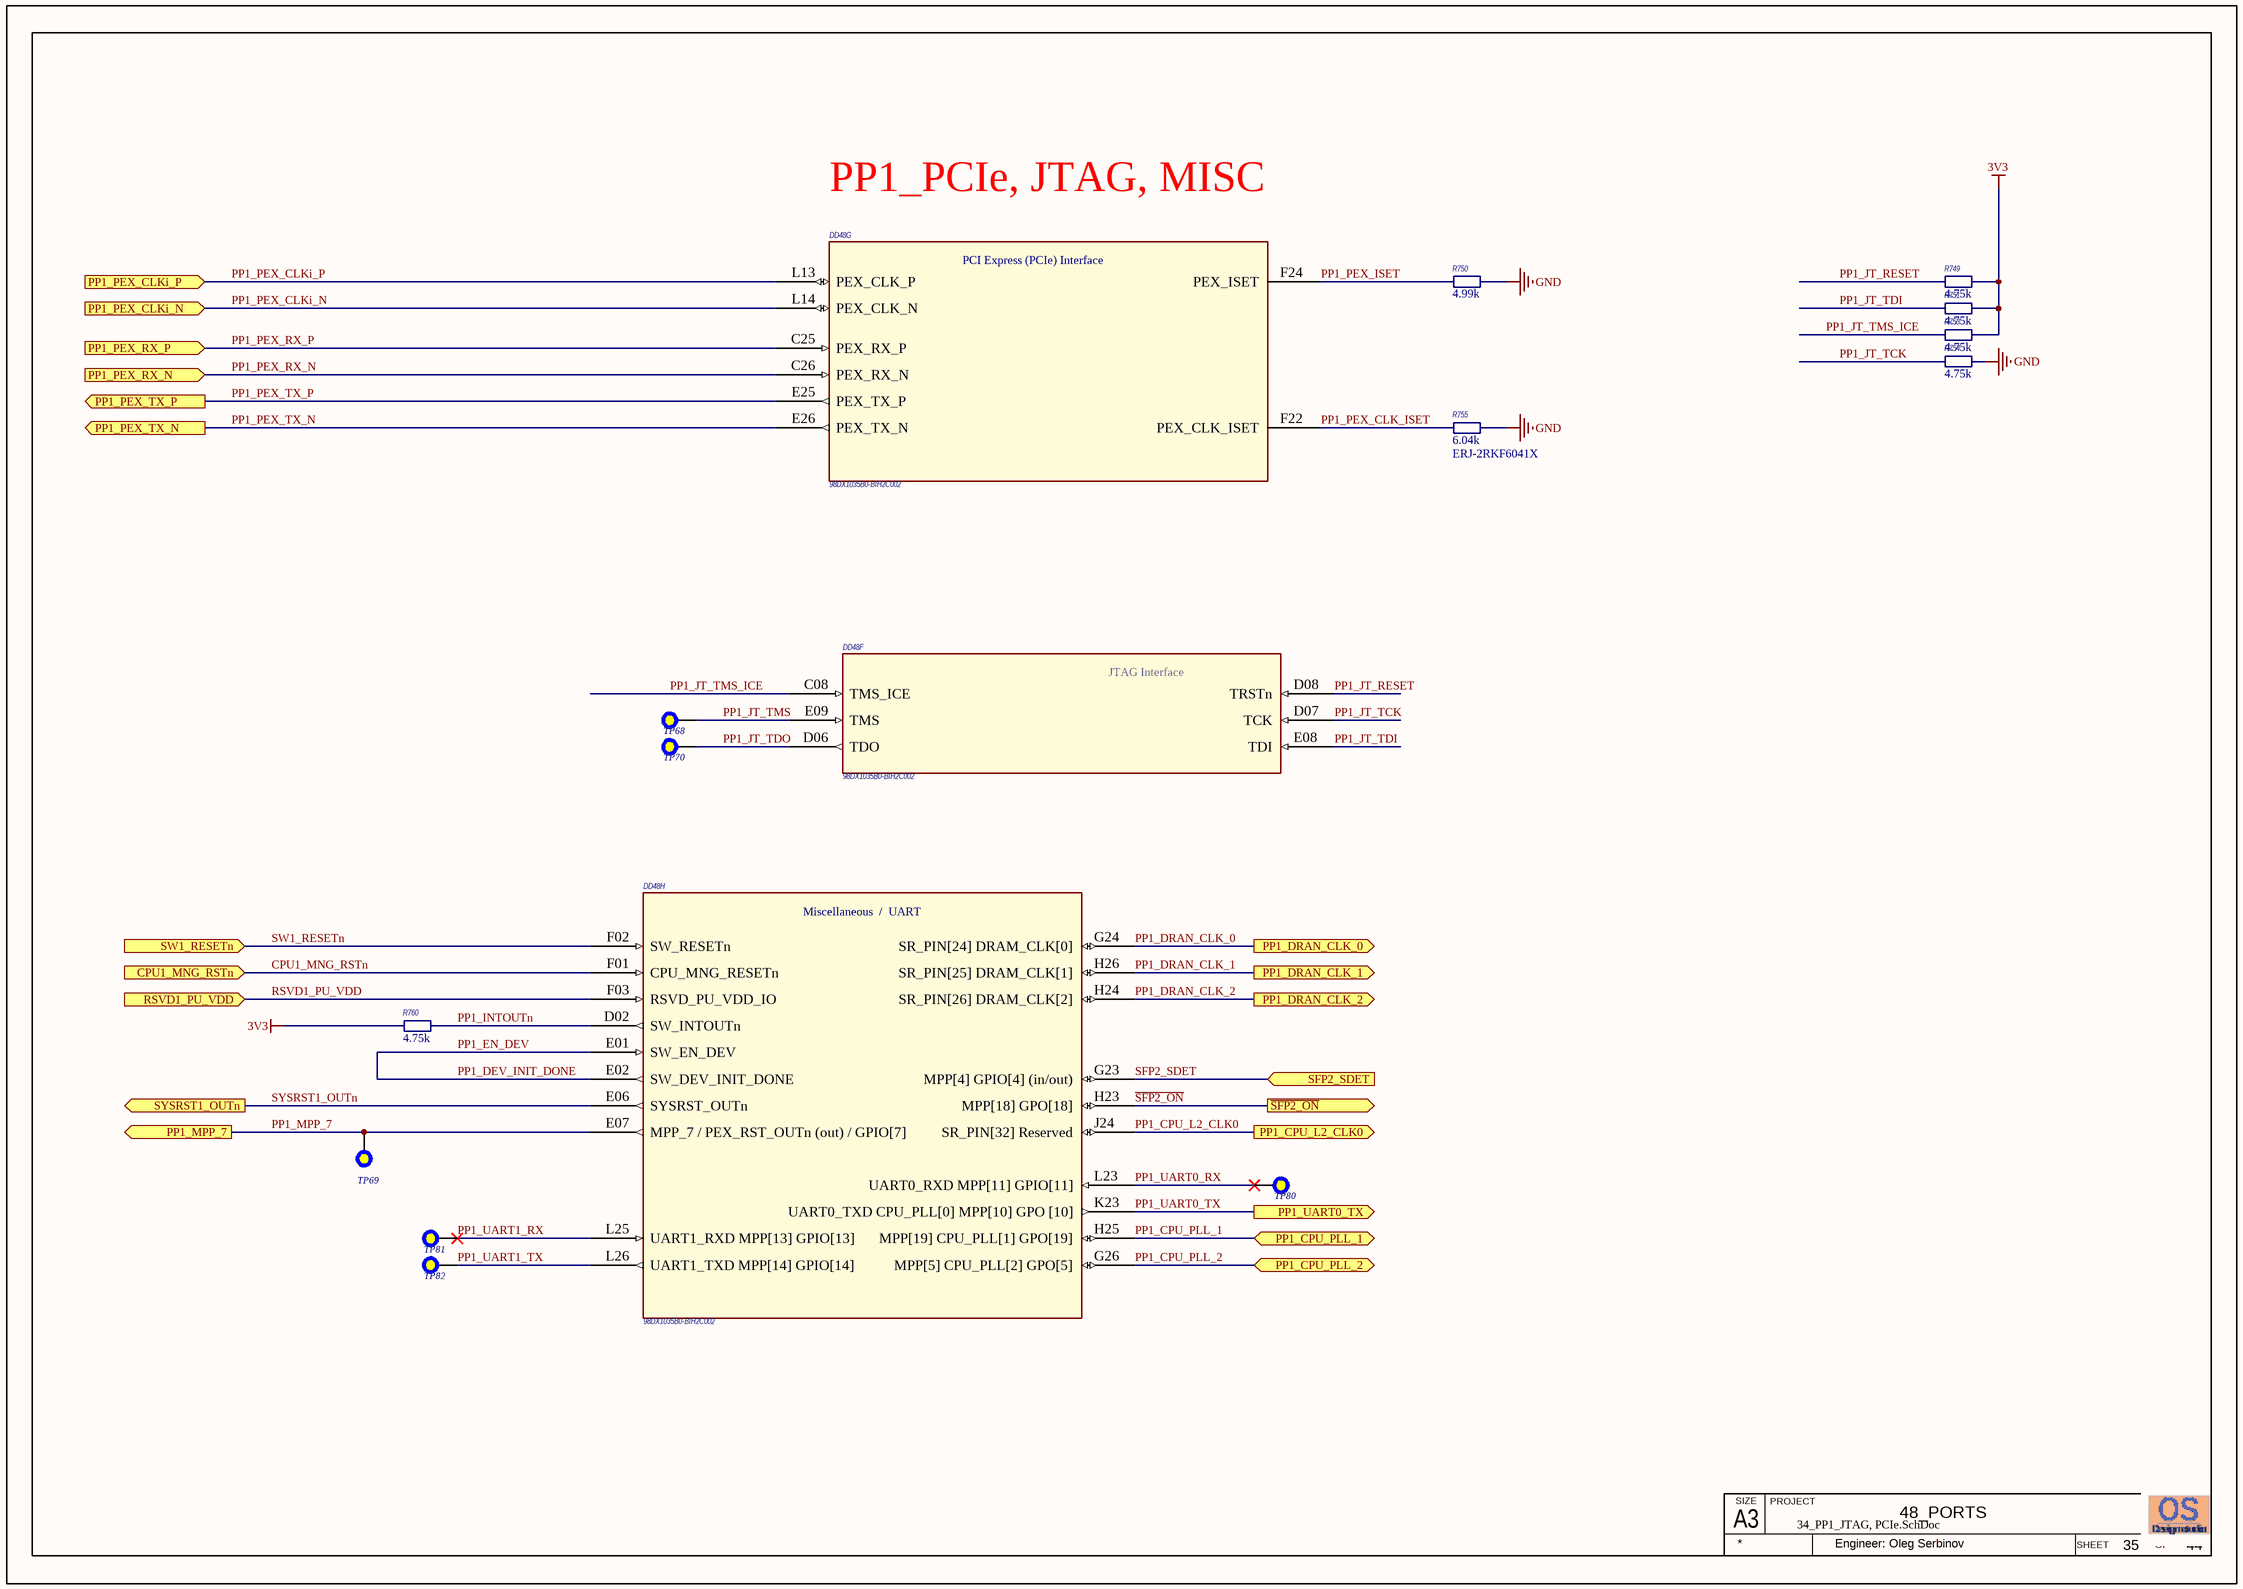
[diagram p20: 34_PP1_JTAG, PCIe.SchDoc]

### Parts
DD48  98DX1035B0-BIH2C002  [HSBGA617_27X27_1MM]  (parts F,G,H of 16)
R749  Resistance (Ohms): 4.75k  [R0402_IPC High Density]  (hidden comment: ERJ-2RKF4751X)
R750  Resistance (Ohms): 4.99k  [R0402_IPC High Density]  (hidden comment: ERJ-2RKF4991X)
R751  Resistance (Ohms): 4.75k  [R0402_IPC High Density]  (hidden comment: ERJ-2RKF4751X)
R753  Resistance (Ohms): 4.75k  [R0402_IPC High Density]  (hidden comment: ERJ-2RKF4751X)
R754  Resistance (Ohms): 4.75k  [R0402_IPC High Density]  (hidden comment: ERJ-2RKF4751X)
R755  Resistance (Ohms): 6.04k  [R0402_IPC High Density]  (hidden comment: ERJ-2RKF6041X)
R760  Resistance (Ohms): 4.75k  [R0402_IPC High Density]  (hidden comment: ERJ-2RKF4751X)
TP68  Test Point 0.5mm pad  [Test Point 0.5mm]  (value not drawn)  (no BOM)
TP69  Test Point 0.5mm pad  [Test Point 0.5mm]  (value not drawn)  (no BOM)
TP70  Test Point 0.5mm pad  [Test Point 0.5mm]  (value not drawn)  (no BOM)
TP80  Test Point 0.5mm pad  [Test Point 0.5mm]  (value not drawn)  (no BOM)
TP81  Test Point 0.5mm pad  [Test Point 0.5mm]  (value not drawn)  (no BOM)
TP82  Test Point 0.5mm pad  [Test Point 0.5mm]  (value not drawn)  (no BOM)

### Ports
CPU1_MNG_RSTn (in), PP1_CPU_L2_CLK0 (out), PP1_CPU_PLL_1 (bidir), PP1_CPU_PLL_2 (bidir), PP1_DRAN_CLK_0 (out), PP1_DRAN_CLK_1 (out), PP1_DRAN_CLK_2 (out), PP1_MPP_7 (out), PP1_PEX_CLKi_N (in), PP1_PEX_CLKi_P (in), PP1_PEX_RX_N (in), PP1_PEX_RX_P (in), PP1_PEX_TX_N (out), PP1_PEX_TX_P (out), PP1_UART0_TX (out), RSVD1_PU_VDD (in), SFP2_SDET (in), SW1_RESETn (in), SYSRST1_OUTn (out), ~{SFP2_ON} (out)

### Nets
3V3: R749.2 R751.2 R753.2 R760.1
GND: R750.2 R754.2 R755.2
~{SFP2_ON}: DD48.H23(MPP[18]_GPO[18]) ; port ~{SFP2_ON}
CPU1_MNG_RSTn: DD48.F01(CPU_MNG_RESETn) ; port CPU1_MNG_RSTn
PP1_CPU_L2_CLK0: DD48.J24(SR_PIN[32]_Reserved) ; port PP1_CPU_L2_CLK0
PP1_CPU_PLL_1: DD48.H25(MPP[19]_CPU_PLL[1]_GPO[19]) ; port PP1_CPU_PLL_1
PP1_CPU_PLL_2: DD48.G26(MPP[5]_CPU_PLL[2]_GPO[5]) ; port PP1_CPU_PLL_2
PP1_DEV_INIT_DONE: DD48.E01(SW_EN_DEV) DD48.E02(SW_DEV_INIT_DONE)  [also labelled PP1_EN_DEV]
PP1_DRAN_CLK_0: DD48.G24(SR_PIN[24]_DRAM_CLK[0]) ; port PP1_DRAN_CLK_0
PP1_DRAN_CLK_1: DD48.H26(SR_PIN[25]_DRAM_CLK[1]) ; port PP1_DRAN_CLK_1
PP1_DRAN_CLK_2: DD48.H24(SR_PIN[26]_DRAM_CLK[2]) ; port PP1_DRAN_CLK_2
PP1_INTOUTn: DD48.D02(SW_INTOUTn) R760.2
PP1_JT_RESET: DD48.D08(TRSTn) R749.1
PP1_JT_TCK: DD48.D07(TCK) R754.1
PP1_JT_TDI: DD48.E08(TDI) R751.1
PP1_JT_TDO: DD48.D06(TDO) TP70.1
PP1_JT_TMS: DD48.E09(TMS) TP68.1
PP1_JT_TMS_ICE: DD48.C08(TMS_ICE) R753.1
PP1_MPP_7: DD48.E07(MPP_7_/_PEX_RST_OUTn_(out)_/_GPIO[7]) TP69.1 ; port PP1_MPP_7
PP1_PEX_CLK_ISET: DD48.F22(PEX_CLK_ISET) R755.1
PP1_PEX_CLKi_N: DD48.L14(PEX_CLK_N) ; port PP1_PEX_CLKi_N
PP1_PEX_CLKi_P: DD48.L13(PEX_CLK_P) ; port PP1_PEX_CLKi_P
PP1_PEX_ISET: DD48.F24(PEX_ISET) R750.1
PP1_PEX_RX_N: DD48.C26(PEX_RX_N) ; port PP1_PEX_RX_N
PP1_PEX_RX_P: DD48.C25(PEX_RX_P) ; port PP1_PEX_RX_P
PP1_PEX_TX_N: DD48.E26(PEX_TX_N) ; port PP1_PEX_TX_N
PP1_PEX_TX_P: DD48.E25(PEX_TX_P) ; port PP1_PEX_TX_P
PP1_UART0_RX: DD48.L23(UART0_RXD_MPP[11]_GPIO[11]) TP80.1
PP1_UART0_TX: DD48.K23(UART0_TXD_CPU_PLL[0]_MPP[10]_GPO_[10]) ; port PP1_UART0_TX
PP1_UART1_RX: DD48.L25(UART1_RXD_MPP[13]_GPIO[13]) TP81.1
PP1_UART1_TX: DD48.L26(UART1_TXD_MPP[14]_GPIO[14]) TP82.1
RSVD1_PU_VDD: DD48.F03(RSVD_PU_VDD_IO) ; port RSVD1_PU_VDD
SFP2_SDET: DD48.G23(MPP[4]_GPIO[4]_(in/out)) ; port SFP2_SDET
SW1_RESETn: DD48.F02(SW_RESETn) ; port SW1_RESETn
SYSRST1_OUTn: DD48.E06(SYSRST_OUTn) ; port SYSRST1_OUTn

### Notes on the sheet
- PP1_PCIe, JTAG, MISC
- A3
- SIZE
- PROJECT
- SHEET
- OF
- Engineer: Oleg Serbinov
- (in symbol 98DX1035A1-BIH2C002, part F) JTAG Interface
- (in symbol 98DX1035A1-BIH2C002, part G) PCI Express (PCIe) Interface
- (in symbol 98DX1035A1-BIH2C002, part H) Miscellaneous  /  UART

### Library data of the parts
DD48 = 98DX1035A1-BIH2C002: as DD39 on sheet 30_PP0_PWR; Manufacturer Part Number: 98DX1035B0-BIH2C002
R749 R751 R753 R754 R760 = ERJ-2RKF4751X: as R702 on sheet 32_PP0_NC; Tolerance: ±1%; Packaging: Cut Tape (CT); Package / Case: 0402 (1005 Metric); Category: Resistors; Manufacturer Part Number: ERJ-2RKF4751X; Supplier Part Number: P4.75KLCT-ND; RoHS: RoHS Compliant; Supplier: Digi-Key; ComponentLink1URL: http://industrial.panasonic.com/www-cgi/jvcr13pz.cgi?E+PZ+3+AOA0002+ERJ2RKF4751X+7+WW; ComponentLink1Description: http://industrial.panasonic.com/www-cgi/jvcr13pz.cgi?E+PZ+3+AOA0002+ERJ2RKF4751X+7+WW; Features: -; Composition: Thick Film; Height: 0.016" (0.40mm); Number of Terminations: 2; Supplier Device Package: 0402; Size / Dimension: 0.039" L x 0.020" W (1.00mm x 0.50mm)
R750 = ERJ-2RKF4991X: R0402, 4.99k 1%; Manufacturer: Panasonic; Customer Part Number: Резистор, 4K99, 0402, 1%; Description 1: RES 4.99K OHM 1/10W 1% 0402 SMD; Category 1: Resistors; Power (Watts): 0.1W, 1/10W; Temperature Coefficient: ±100ppm/°C; Analogs: any suitable; Supplier 1: Digi-Key; Supplier Part Number 1: P4.99KLTR-ND; RoHS 1: RoHS Compliant; Stock 1: 950000; Pricing 1: 10000=0.00347, 30000=0.00305, 50000=0.00279, 100000=0.00274 (USD); Composition: Thick Film; Features: -; Tolerance: ±1%; Package / Case: 0402 (1005 Metric); Size / Dimension: 0.039" L x 0.020" W (1.00mm x 0.50mm); Height: 0.016" (0.40mm); Number of Terminations: 2; Packaging: Tape & Reel (TR); ComponentLink1URL: http://industrial.panasonic.com/www-cgi/jvcr13pz.cgi?E+PZ+3+AOA0002+ERJ2RKF4991X+7+WW; ComponentLink1Description: http://industrial.panasonic.com/www-cgi/jvcr13pz.cgi?E+PZ+3+AOA0002+ERJ2RKF4991X+7+WW; Supplier Part Number: P4.99KLTR-ND; Manufacturer Part Number: ERJ-2RKF4991X; RoHS: RoHS Compliant; Supplier: Digi-Key; Category: Resistors; Pricing: 10000=0.00347, 30000=0.00305, 50000=0.00279, 100000=0.00274 (USD)
R755 = ERJ-2RKF6041X: R0402, 6.04k 1%; Manufacturer: Panasonic; Rpart number: RC0402FR-076K04L ; RC1005F6041CS ; RMCF0402FT6K04 ; CRCW04026K04FKED ; TRR01MZPF6041 ; RC-02W6041FT; Rmanufacturer: Yageo  Samsung  Stackpole Electronics  Rohm Semiconductor  Vishay Dale; Customer Part Number: Резистор, 6K04, 0402, 1%; Description 1: RES 6.04K OHM 1/10W 1% 0402 SMD; Category 1: Resistors; Power (Watts): 0.1W, 1/10W; Temperature Coefficient: ±100ppm/°C; Analogs: any suitable; Tolerance: ±1%; Supplier 1: Digi-Key; Supplier Part Number 1: P6.04KLCT-ND; RoHS 1: RoHS Compliant; Stock 1: 566346; Pricing 1: 1=0.1, 50=0.0242, 100=0.0184, 250=0.01364, 500=0.01008, 1000=0.00672, 5000=0.00473 (USD); Composition: Thick Film; Features: -; Package / Case: 0402 (1005 Metric); Size / Dimension: 0.039" L x 0.020" W (1.00mm x 0.50mm); Height: 0.016" (0.40mm); Number of Terminations: 2; Packaging: Cut Tape (CT); ComponentLink1URL: http://industrial.panasonic.com/www-cgi/jvcr13pz.cgi?E+PZ+3+AOA0002+ERJ2RKF6041X+7+WW; ComponentLink1Description: http://industrial.panasonic.com/www-cgi/jvcr13pz.cgi?E+PZ+3+AOA0002+ERJ2RKF6041X+7+WW; RoHS: RoHS Compliant; Supplier Part Number: P6.04KLCT-ND; Category: Resistors; Supplier: Digi-Key; Pricing: 1=0.1, 50=0.0242, 100=0.0184, 250=0.01364, 500=0.01008, 1000=0.00672, 5000=0.00473 (USD); Manufacturer Part Number: ERJ-2RKF6041X

## Sheet 39_PP1_DDR.SchDoc
size 419 x 296 mm; Author: Serbinov O.A.; CompanyName: ELSICOM; DrawnBy: Serbinov O.A.; Engineer: Serbinov O.A.; Organization: Elsicom; Address1: Kirova avenue, 58; Address2: Tomsk; Address3: Russia 634012; DocumentNumber: 40; SheetNumber: 40; SheetTotal: 44; ProjectName: 48_PORTS
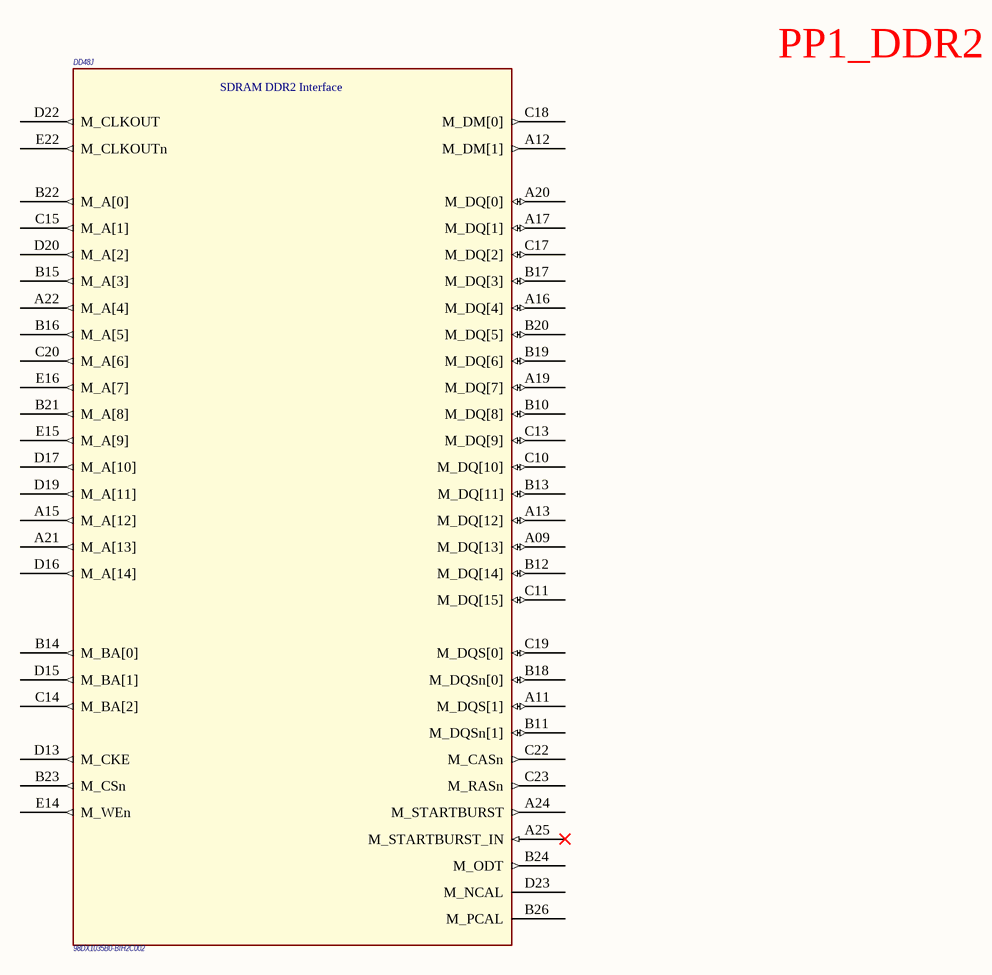
[diagram p21: 39_PP1_DDR.SchDoc]

### Parts
DD48  98DX1035B0-BIH2C002  [HSBGA617_27X27_1MM]  (part J of 16)

### Nets

Not connected (* = marked no-connect by the designer): DD48 A09(M_DQ[13]) A11(M_DQS[1]) A12(M_DM[1]) A13(M_DQ[12]) A15(M_A[12]) A16(M_DQ[4]) A17(M_DQ[1]) A19(M_DQ[7]) A20(M_DQ[0]) A21(M_A[13]) A22(M_A[4]) A24(M_STARTBURST) A25(M_STARTBURST_IN)* B10(M_DQ[8]) B11(M_DQSn[1]) B12(M_DQ[14]) B13(M_DQ[11]) B14(M_BA[0]) B15(M_A[3]) B16(M_A[5]) B17(M_DQ[3]) B18(M_DQSn[0]) B19(M_DQ[6]) B20(M_DQ[5]) B21(M_A[8]) B22(M_A[0]) B23(M_CSn) B24(M_ODT) B26(M_PCAL) C10(M_DQ[10]) C11(M_DQ[15]) C13(M_DQ[9]) C14(M_BA[2]) C15(M_A[1]) C17(M_DQ[2]) C18(M_DM[0]) C19(M_DQS[0]) C20(M_A[6]) C22(M_CASn) C23(M_RASn) D13(M_CKE) D15(M_BA[1]) D16(M_A[14]) D17(M_A[10]) D19(M_A[11]) D20(M_A[2]) D22(M_CLKOUT) D23(M_NCAL) E14(M_WEn) E15(M_A[9]) E16(M_A[7]) E22(M_CLKOUTn)

### Notes on the sheet
- PP1_DDR2
- A3
- SIZE
- PROJECT
- SHEET
- OF
- Engineer: Oleg Serbinov
- (in symbol 98DX1035A1-BIH2C002, part J) SDRAM DDR2 Interface

### Library data of the parts
DD48 = 98DX1035A1-BIH2C002: as DD39 on sheet 30_PP0_PWR; Manufacturer Part Number: 98DX1035B0-BIH2C002

## Sheet 40_PP1_PWR.SchDoc
size 419 x 296 mm; Author: Serbinov O.A.; CompanyName: ELSICOM; DrawnBy: Serbinov O.A.; Engineer: Serbinov O.A.; Organization: Elsicom; Address1: Kirova avenue, 58; Address2: Tomsk; Address3: Russia 634012; DocumentNumber: 41; SheetNumber: 41; SheetTotal: 44; ProjectName: 48_PORTS
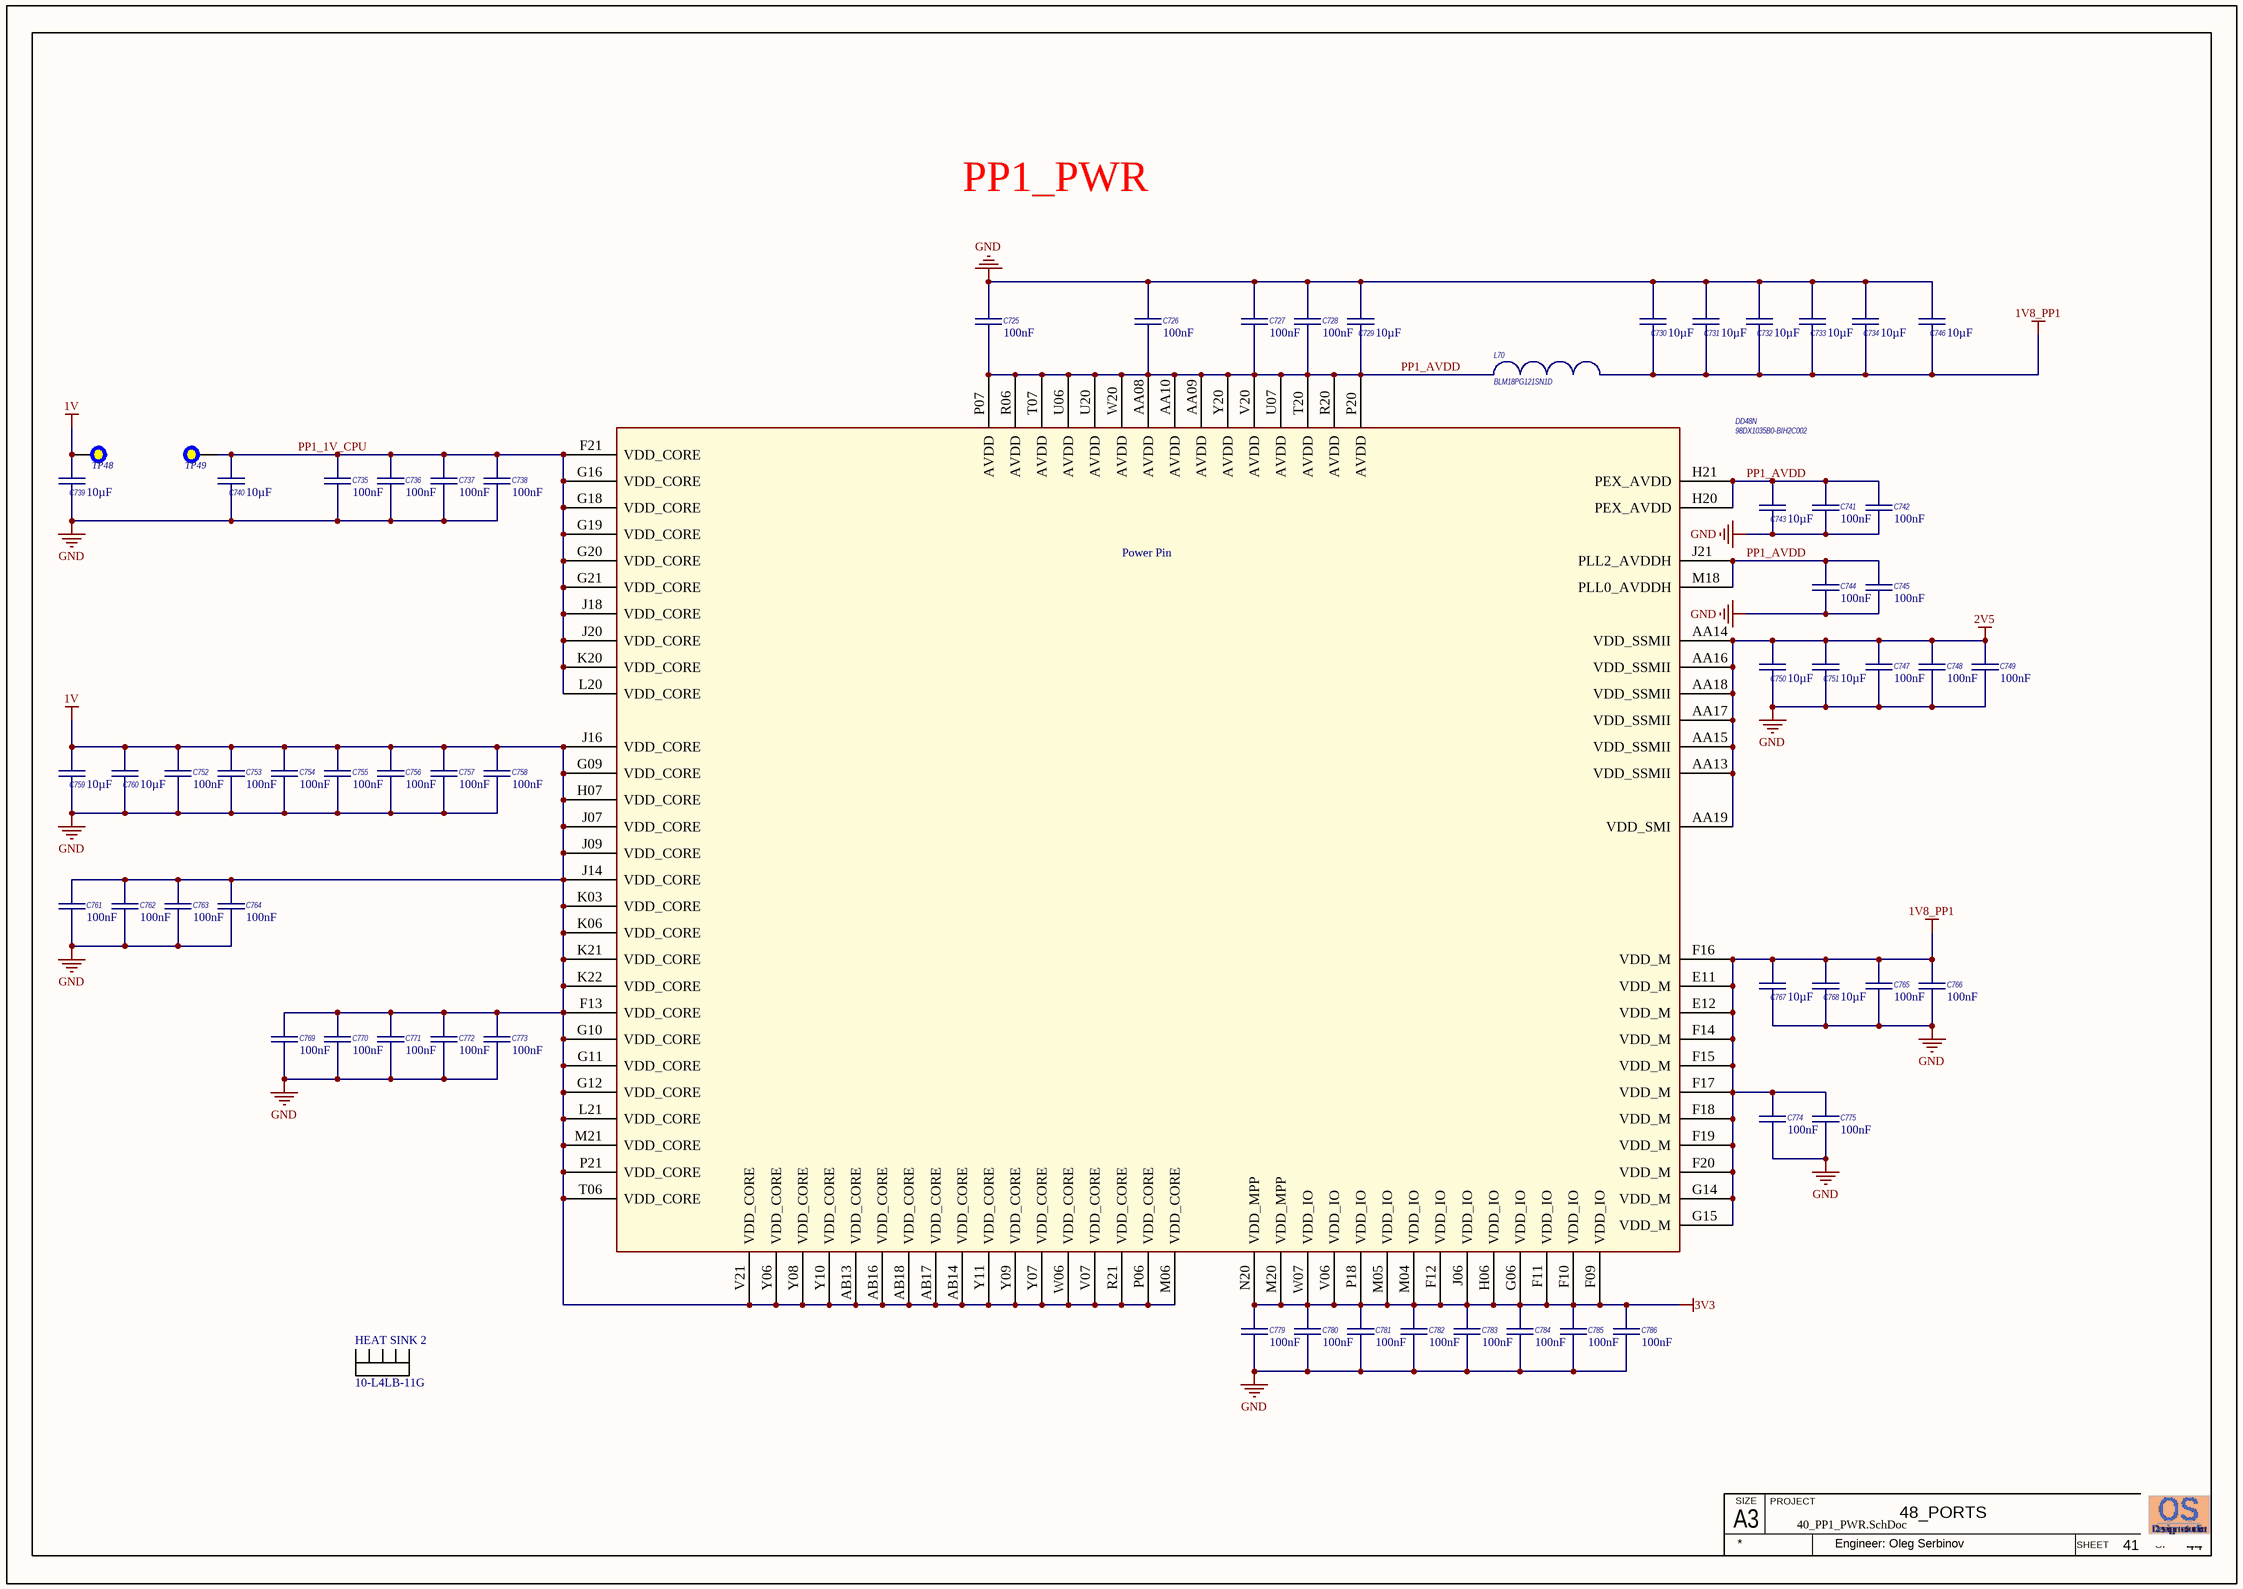
[diagram p22: 40_PP1_PWR.SchDoc]

### Parts
C725  Capacitance: 100nF  [C0402_IPC High Density]  (hidden comment: GRM155R71E104KE14D)
C726  Capacitance: 100nF  [C0402_IPC High Density]  (hidden comment: GRM155R71E104KE14D)
C727  Capacitance: 100nF  [C0402_IPC High Density]  (hidden comment: GRM155R71E104KE14D)
C728  Capacitance: 100nF  [C0402_IPC High Density]  (hidden comment: GRM155R71E104KE14D)
C729  Capacitance: 10µF  [CAPC2012[0805]]  (hidden comment: GRM21BR61C106KE15)
C730  Capacitance: 10µF  [CAPC2012[0805]]  (hidden comment: GRM21BR61C106KE15)
C731  Capacitance: 10µF  [CAPC2012[0805]]  (hidden comment: GRM21BR61C106KE15)
C732  Capacitance: 10µF  [CAPC2012[0805]]  (hidden comment: GRM21BR61C106KE15)
C733  Capacitance: 10µF  [CAPC2012[0805]]  (hidden comment: GRM21BR61C106KE15)
C734  Capacitance: 10µF  [CAPC2012[0805]]  (hidden comment: GRM21BR61C106KE15)
C735  Capacitance: 100nF  [C0402_IPC High Density]  (hidden comment: GRM155R71E104KE14D)
C736  Capacitance: 100nF  [C0402_IPC High Density]  (hidden comment: GRM155R71E104KE14D)
C737  Capacitance: 100nF  [C0402_IPC High Density]  (hidden comment: GRM155R71E104KE14D)
C738  Capacitance: 100nF  [C0402_IPC High Density]  (hidden comment: GRM155R71E104KE14D)
C739  Capacitance: 10µF  [CAPC2012[0805]]  (hidden comment: GRM21BR61C106KE15)
C740  Capacitance: 10µF  [CAPC2012[0805]]  (hidden comment: GRM21BR61C106KE15)
C741  Capacitance: 100nF  [C0402_IPC High Density]  (hidden comment: GRM155R71E104KE14D)
C742  Capacitance: 100nF  [C0402_IPC High Density]  (hidden comment: GRM155R71E104KE14D)
C743  Capacitance: 10µF  [CAPC2012[0805]]  (hidden comment: GRM21BR61C106KE15)
C744  Capacitance: 100nF  [C0402_IPC High Density]  (hidden comment: GRM155R71E104KE14D)
C745  Capacitance: 100nF  [C0402_IPC High Density]  (hidden comment: GRM155R71E104KE14D)
C746  Capacitance: 10µF  [CAPC2012[0805]]  (hidden comment: GRM21BR61C106KE15)
C747  Capacitance: 100nF  [C0402_IPC High Density]  (hidden comment: GRM155R71E104KE14D)
C748  Capacitance: 100nF  [C0402_IPC High Density]  (hidden comment: GRM155R71E104KE14D)
C749  Capacitance: 100nF  [C0402_IPC High Density]  (hidden comment: GRM155R71E104KE14D)
C750  Capacitance: 10µF  [CAPC2012[0805]]  (hidden comment: GRM21BR61C106KE15)
C751  Capacitance: 10µF  [CAPC2012[0805]]  (hidden comment: GRM21BR61C106KE15)
C752  Capacitance: 100nF  [C0402_IPC High Density]  (hidden comment: GRM155R71E104KE14D)
C753  Capacitance: 100nF  [C0402_IPC High Density]  (hidden comment: GRM155R71E104KE14D)
C754  Capacitance: 100nF  [C0402_IPC High Density]  (hidden comment: GRM155R71E104KE14D)
C755  Capacitance: 100nF  [C0402_IPC High Density]  (hidden comment: GRM155R71E104KE14D)
C756  Capacitance: 100nF  [C0402_IPC High Density]  (hidden comment: GRM155R71E104KE14D)
C757  Capacitance: 100nF  [C0402_IPC High Density]  (hidden comment: GRM155R71E104KE14D)
C758  Capacitance: 100nF  [C0402_IPC High Density]  (hidden comment: GRM155R71E104KE14D)
C759  Capacitance: 10µF  [CAPC2012[0805]]  (hidden comment: GRM21BR61C106KE15)
C760  Capacitance: 10µF  [CAPC2012[0805]]  (hidden comment: GRM21BR61C106KE15)
C761  Capacitance: 100nF  [C0402_IPC High Density]  (hidden comment: GRM155R71E104KE14D)
C762  Capacitance: 100nF  [C0402_IPC High Density]  (hidden comment: GRM155R71E104KE14D)
C763  Capacitance: 100nF  [C0402_IPC High Density]  (hidden comment: GRM155R71E104KE14D)
C764  Capacitance: 100nF  [C0402_IPC High Density]  (hidden comment: GRM155R71E104KE14D)
C765  Capacitance: 100nF  [C0402_IPC High Density]  (hidden comment: GRM155R71E104KE14D)
C766  Capacitance: 100nF  [C0402_IPC High Density]  (hidden comment: GRM155R71E104KE14D)
C767  Capacitance: 10µF  [CAPC2012[0805]]  (hidden comment: GRM21BR61C106KE15)
C768  Capacitance: 10µF  [CAPC2012[0805]]  (hidden comment: GRM21BR61C106KE15)
C769  Capacitance: 100nF  [C0402_IPC High Density]  (hidden comment: GRM155R71E104KE14D)
C770  Capacitance: 100nF  [C0402_IPC High Density]  (hidden comment: GRM155R71E104KE14D)
C771  Capacitance: 100nF  [C0402_IPC High Density]  (hidden comment: GRM155R71E104KE14D)
C772  Capacitance: 100nF  [C0402_IPC High Density]  (hidden comment: GRM155R71E104KE14D)
C773  Capacitance: 100nF  [C0402_IPC High Density]  (hidden comment: GRM155R71E104KE14D)
C774  Capacitance: 100nF  [C0402_IPC High Density]  (hidden comment: GRM155R71E104KE14D)
C775  Capacitance: 100nF  [C0402_IPC High Density]  (hidden comment: GRM155R71E104KE14D)
C779  Capacitance: 100nF  [C0402_IPC High Density]  (hidden comment: GRM155R71E104KE14D)
C780  Capacitance: 100nF  [C0402_IPC High Density]  (hidden comment: GRM155R71E104KE14D)
C781  Capacitance: 100nF  [C0402_IPC High Density]  (hidden comment: GRM155R71E104KE14D)
C782  Capacitance: 100nF  [C0402_IPC High Density]  (hidden comment: GRM155R71E104KE14D)
C783  Capacitance: 100nF  [C0402_IPC High Density]  (hidden comment: GRM155R71E104KE14D)
C784  Capacitance: 100nF  [C0402_IPC High Density]  (hidden comment: GRM155R71E104KE14D)
C785  Capacitance: 100nF  [C0402_IPC High Density]  (hidden comment: GRM155R71E104KE14D)
C786  Capacitance: 100nF  [C0402_IPC High Density]  (hidden comment: GRM155R71E104KE14D)
DD48  98DX1035B0-BIH2C002  [HSBGA617_27X27_1MM]  (part N of 16)
HEAT_SINK_2  10-L4LB-11G  [10-L4LB-11G]  (no BOM)
L70  BLM18PG121SN1D  [INDC1608X95N]
TP48  Test Point 0.5mm pad  [Test Point 0.5mm]  (value not drawn)  (no BOM)
TP49  Test Point 0.5mm pad  [Test Point 0.5mm]  (value not drawn)  (no BOM)

### Nets
1V: C739.2 C752.1 C753.1 C754.1 C755.1 C756.1 C757.1 C758.1 C759.2 C760.2 C761.1 C762.1 C763.1 C764.1 C769.1 C770.1 C771.1 C772.1 C773.1 DD48.AB13(VDD_CORE) DD48.AB14(VDD_CORE) DD48.AB16(VDD_CORE) DD48.AB17(VDD_CORE) DD48.AB18(VDD_CORE) DD48.F13(VDD_CORE) DD48.G09(VDD_CORE) DD48.G10(VDD_CORE) DD48.G11(VDD_CORE) DD48.G12(VDD_CORE) DD48.H07(VDD_CORE) DD48.J07(VDD_CORE) DD48.J09(VDD_CORE) DD48.J14(VDD_CORE) DD48.J16(VDD_CORE) DD48.K03(VDD_CORE) DD48.K06(VDD_CORE) DD48.K21(VDD_CORE) DD48.K22(VDD_CORE) DD48.L21(VDD_CORE) DD48.M06(VDD_CORE) DD48.M21(VDD_CORE) DD48.P06(VDD_CORE) DD48.P21(VDD_CORE) DD48.R21(VDD_CORE) DD48.T06(VDD_CORE) DD48.V07(VDD_CORE) DD48.V21(VDD_CORE) DD48.W06(VDD_CORE) DD48.Y06(VDD_CORE) DD48.Y07(VDD_CORE) DD48.Y08(VDD_CORE) DD48.Y09(VDD_CORE) DD48.Y10(VDD_CORE) DD48.Y11(VDD_CORE) TP48.1
1V8_PP1: C730.1 C731.1 C732.1 C733.1 C734.1 C746.1 C765.1 C766.1 C767.2 C768.2 C774.1 C775.1 DD48.E11(VDD_M) DD48.E12(VDD_M) DD48.F14(VDD_M) DD48.F15(VDD_M) DD48.F16(VDD_M) DD48.F17(VDD_M) DD48.F18(VDD_M) DD48.F19(VDD_M) DD48.F20(VDD_M) DD48.G14(VDD_M) DD48.G15(VDD_M) L70.2
2V5: C747.1 C748.1 C749.1 C750.2 C751.2 DD48.AA13(VDD_SSMII) DD48.AA14(VDD_SSMII) DD48.AA15(VDD_SSMII) DD48.AA16(VDD_SSMII) DD48.AA17(VDD_SSMII) DD48.AA18(VDD_SSMII) DD48.AA19(VDD_SMI)
3V3: C779.1 C780.1 C781.1 C782.1 C783.1 C784.1 C785.1 C786.1 DD48.F09(VDD_IO) DD48.F10(VDD_IO) DD48.F11(VDD_IO) DD48.F12(VDD_IO) DD48.G06(VDD_IO) DD48.H06(VDD_IO) DD48.J06(VDD_IO) DD48.M04(VDD_IO) DD48.M05(VDD_IO) DD48.M20(VDD_MPP) DD48.N20(VDD_MPP) DD48.P18(VDD_IO) DD48.V06(VDD_IO) DD48.W07(VDD_IO)
GND: C725.1 C726.1 C727.1 C728.1 C729.2 C730.2 C731.2 C732.2 C733.2 C734.2 C735.2 C736.2 C737.2 C738.2 C739.1 C740.1 C741.2 C742.2 C743.1 C744.2 C745.2 C746.2 C747.2 C748.2 C749.2 C750.1 C751.1 C752.2 C753.2 C754.2 C755.2 C756.2 C757.2 C758.2 C759.1 C760.1 C761.2 C762.2 C763.2 C764.2 C765.2 C766.2 C767.1 C768.1 C769.2 C770.2 C771.2 C772.2 C773.2 C774.2 C775.2 C779.2 C780.2 C781.2 C782.2 C783.2 C784.2 C785.2 C786.2
PP1_1V_CPU: C735.1 C736.1 C737.1 C738.1 C740.2 DD48.F21(VDD_CORE) DD48.G16(VDD_CORE) DD48.G18(VDD_CORE) DD48.G19(VDD_CORE) DD48.G20(VDD_CORE) DD48.G21(VDD_CORE) DD48.J18(VDD_CORE) DD48.J20(VDD_CORE) DD48.K20(VDD_CORE) DD48.L20(VDD_CORE) TP49.1
PP1_AVDD: C725.2 C726.2 C727.2 C728.2 C729.1 C741.1 C742.1 C743.2 C744.1 C745.1 DD48.AA08(AVDD) DD48.AA09(AVDD) DD48.AA10(AVDD) DD48.H20(PEX_AVDD) DD48.H21(PEX_AVDD) DD48.J21(PLL2_AVDDH) DD48.M18(PLL0_AVDDH) DD48.P07(AVDD) DD48.P20(AVDD) DD48.R06(AVDD) DD48.R20(AVDD) DD48.T07(AVDD) DD48.T20(AVDD) DD48.U06(AVDD) DD48.U07(AVDD) DD48.U20(AVDD) DD48.V20(AVDD) DD48.W20(AVDD) DD48.Y20(AVDD) L70.1

### Notes on the sheet
- PP1_PWR
- A3
- SIZE
- PROJECT
- SHEET
- OF
- Engineer: Oleg Serbinov
- (in symbol 98DX1035A1-BIH2C002, part N) Power Pin

### Library data of the parts
C725-C728 C735-C738 C741 C742 C744 C745 C747-C749 C752-C758 C761-C766 C769-C775 C779-C786 = GRM155R71E104KE14D: as C604-C607 on sheet 30_PP0_PWR; Manufacturer Part Number: GRM155R71E104KE14D; RoHS: YES; Packaging: Reel; Package / Case: 0402; ComponentLink1URL: http://www.farnell.com/datasheets/4360.pdf; ComponentLink1Description: http://www.farnell.com/datasheets/4360.pdf; Pricing: 10000=0.008593, 30000=0.007991 (GBP); Supplier 1: Farnell; Supplier Part Number 1: 1118151; Stock: 3; Dielectric Characteristic: X7R; Operating Temperature Min: -55; Operating Temperature Max: 125; Operating Temperature Range: -55°C to +125; Series: GRM Hi-Cap; Terminal Type: Surface Mount (SMD, SMT); Tolerance -: 10%; Voltage Rating V DC: 16
C729-C734 C739 C740 C743 C746 C750 C751 C759 C760 C767 C768 = GRM21BR61C106KE15: as C608-C613 on sheet 30_PP0_PWR; Applications: General Purpose; Category: Capacitors; Operating Temperature: -55°C ~ 85°C; Package / Case: 0805 (2012 Metric); Size / Dimension: 0.079" L x 0.049" W (2.00mm x 1.25mm); Temperature Coefficient: X5R; Tolerance: ±10%; ComponentLink1URL: http://search.murata.co.jp/Ceramy/image/img/PDF/ENG/GRM21BR61C106KE15.pdf; ComponentLink1Description: http://search.murata.co.jp/Ceramy/image/img/PDF/ENG/GRM21BR61C106KE15.pdf; Pricing: 1=0.3, 10=0.25, 50=0.1408, 100=0.1252, 250=0.09392, 500=0.08294, 1000=0.07356 (USD); Voltage - Rated: 16V; Manufacturer Part Number: GRM21BR61C106KE15
DD48 = 98DX1035A1-BIH2C002: as DD39 on sheet 30_PP0_PWR; Manufacturer Part Number: 98DX1035B0-BIH2C002
HEAT_SINK_2 = 10-L4LB-11G: as HEAT_SINK_1 on sheet 30_PP0_PWR; Manufacturer Part Number: 10-L4LB-11G
L70 = BLM18PG121SN1D: as L66-L69 on sheet 30_PP0_PWR; RoHS: YES; Operating Temperature Min: -55; Mounting Type: SMD; Operating Temperature Max: +125; Package / Case: 0603; Impedance @ 100MHz Typ: 120; Resistance: 0.05; Supplier Part Number: 1515738; Supplier: Farnell; ComponentLink1URL: http://www.farnell.com/datasheets/5148.pdf; ComponentLink1Description: http://www.farnell.com/datasheets/5148.pdf; Pricing: 5=0.056, 50=0.041, 100=0.034, 250=0.028, 500=0.027 (GBP); Manufacturer Part Number: BLM18PG121SN1D; DC Current Rating: 2A; Analogs: MPZ1608S121ATAH0 ; CIC10P121NC ; MPZ1608S121ATDH5 ; BLM18PG121SH1D ; 742792625

## Sheet 41_PP1_GND.SchDoc
size 419 x 296 mm; Author: Serbinov O.A.; CompanyName: ELSICOM; DrawnBy: Serbinov O.A.; Engineer: Serbinov O.A.; Organization: Elsicom; Address1: Kirova avenue, 58; Address2: Tomsk; Address3: Russia 634012; DocumentNumber: 42; SheetNumber: 42; SheetTotal: 44; ProjectName: 48_PORTS
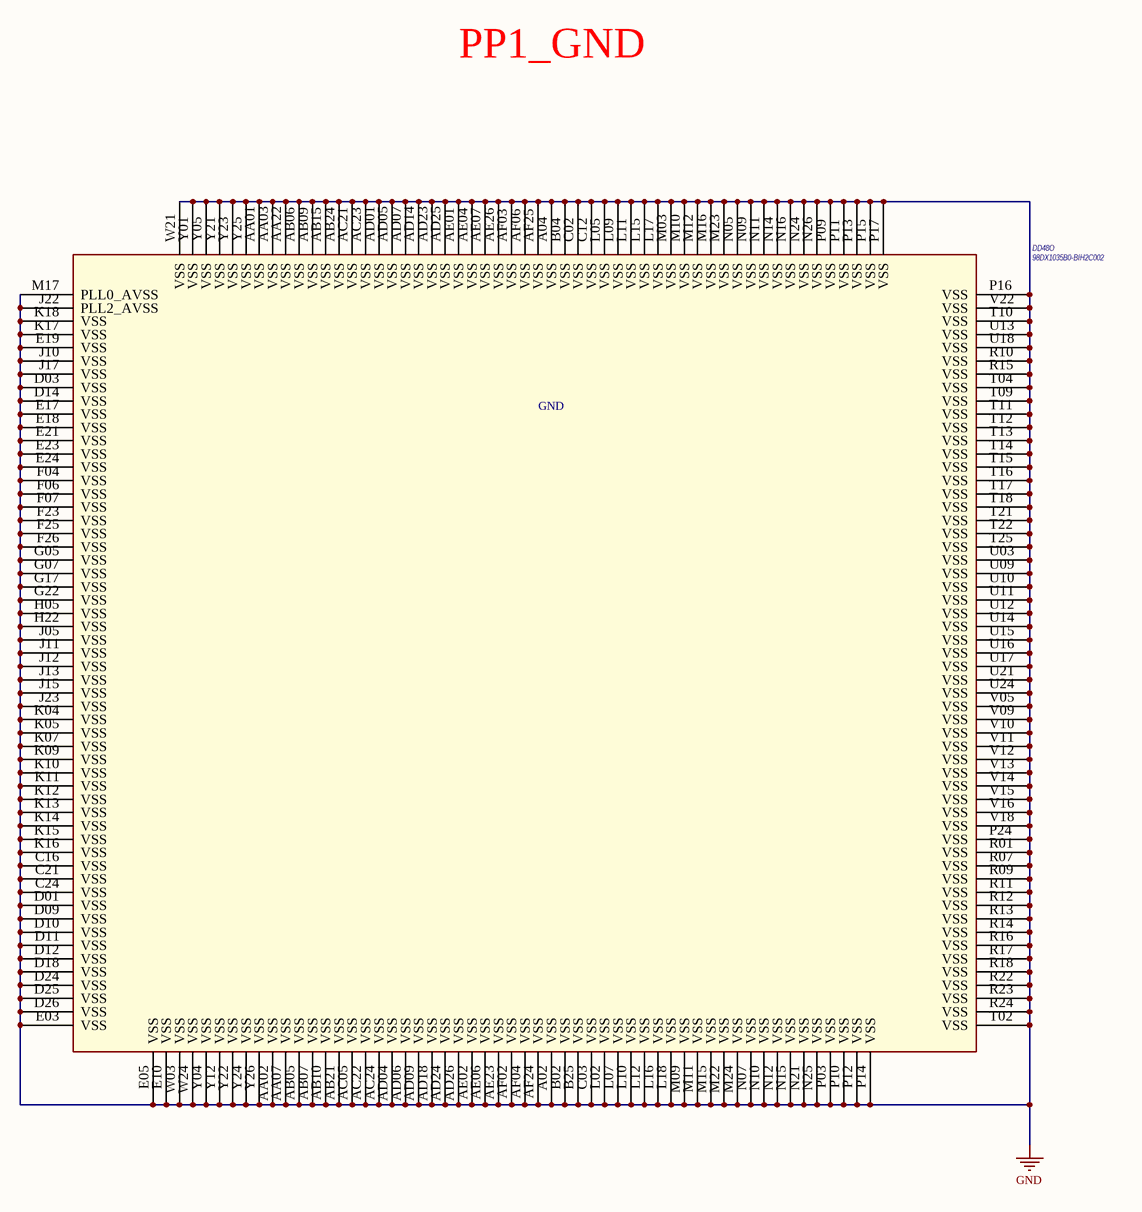
[diagram p23: 41_PP1_GND.SchDoc]

### Parts
DD48  98DX1035B0-BIH2C002  [HSBGA617_27X27_1MM]  (part O of 16)

### Nets
GND: DD48.A02(VSS) DD48.A04(VSS) DD48.AA01(VSS) DD48.AA02(VSS) DD48.AA03(VSS) DD48.AA07(VSS) DD48.AA22(VSS) DD48.AB05(VSS) DD48.AB06(VSS) DD48.AB07(VSS) DD48.AB09(VSS) DD48.AB10(VSS) DD48.AB15(VSS) DD48.AB21(VSS) DD48.AB24(VSS) DD48.AC05(VSS) DD48.AC21(VSS) DD48.AC22(VSS) DD48.AC23(VSS) DD48.AC24(VSS) DD48.AD01(VSS) DD48.AD04(VSS) DD48.AD05(VSS) DD48.AD06(VSS) DD48.AD07(VSS) DD48.AD09(VSS) DD48.AD14(VSS) DD48.AD18(VSS) DD48.AD23(VSS) DD48.AD24(VSS) DD48.AD25(VSS) DD48.AD26(VSS) DD48.AE01(VSS) DD48.AE02(VSS) DD48.AE04(VSS) DD48.AE06(VSS) DD48.AE07(VSS) DD48.AE23(VSS) DD48.AE26(VSS) DD48.AF02(VSS) DD48.AF03(VSS) DD48.AF04(VSS) DD48.AF06(VSS) DD48.AF24(VSS) DD48.AF25(VSS) DD48.B02(VSS) DD48.B04(VSS) DD48.B25(VSS) DD48.C02(VSS) DD48.C03(VSS) DD48.C12(VSS) DD48.C16(VSS) DD48.C21(VSS) DD48.C24(VSS) DD48.D01(VSS) DD48.D03(VSS) DD48.D09(VSS) DD48.D10(VSS) DD48.D11(VSS) DD48.D12(VSS) DD48.D14(VSS) DD48.D18(VSS) DD48.D24(VSS) DD48.D25(VSS) DD48.D26(VSS) DD48.E03(VSS) DD48.E05(VSS) DD48.E10(VSS) DD48.E17(VSS) DD48.E18(VSS) DD48.E19(VSS) DD48.E21(VSS) DD48.E23(VSS) DD48.E24(VSS) DD48.F04(VSS) DD48.F06(VSS) DD48.F07(VSS) DD48.F23(VSS) DD48.F25(VSS) DD48.F26(VSS) DD48.G05(VSS) DD48.G07(VSS) DD48.G17(VSS) DD48.G22(VSS) DD48.H05(VSS) DD48.H22(VSS) DD48.J05(VSS) DD48.J10(VSS) DD48.J11(VSS) DD48.J12(VSS) DD48.J13(VSS) DD48.J15(VSS) DD48.J17(VSS) DD48.J22(PLL2_AVSS) DD48.J23(VSS) DD48.K04(VSS) DD48.K05(VSS) DD48.K07(VSS) DD48.K09(VSS) DD48.K10(VSS) DD48.K11(VSS) DD48.K12(VSS) DD48.K13(VSS) DD48.K14(VSS) DD48.K15(VSS) DD48.K16(VSS) DD48.K17(VSS) DD48.K18(VSS) DD48.L02(VSS) DD48.L05(VSS) DD48.L07(VSS) DD48.L09(VSS) DD48.L10(VSS) DD48.L11(VSS) DD48.L12(VSS) DD48.L15(VSS) DD48.L16(VSS) DD48.L17(VSS) DD48.L18(VSS) DD48.M03(VSS) DD48.M09(VSS) DD48.M10(VSS) DD48.M11(VSS) DD48.M12(VSS) DD48.M15(VSS) DD48.M16(VSS) DD48.M17(PLL0_AVSS) DD48.M22(VSS) DD48.M23(VSS) DD48.M24(VSS) DD48.N05(VSS) DD48.N07(VSS) DD48.N09(VSS) DD48.N10(VSS) DD48.N11(VSS) DD48.N12(VSS) DD48.N14(VSS) DD48.N15(VSS) DD48.N16(VSS) DD48.N21(VSS) DD48.N24(VSS) DD48.N25(VSS) DD48.N26(VSS) DD48.P03(VSS) DD48.P09(VSS) DD48.P10(VSS) DD48.P11(VSS) DD48.P12(VSS) DD48.P13(VSS) DD48.P14(VSS) DD48.P15(VSS) DD48.P16(VSS) DD48.P17(VSS) DD48.P24(VSS) DD48.R01(VSS) DD48.R07(VSS) DD48.R09(VSS) DD48.R10(VSS) DD48.R11(VSS) DD48.R12(VSS) DD48.R13(VSS) DD48.R14(VSS) DD48.R15(VSS) DD48.R16(VSS) DD48.R17(VSS) DD48.R18(VSS) DD48.R22(VSS) DD48.R23(VSS) DD48.R24(VSS) DD48.T02(VSS) DD48.T04(VSS) DD48.T09(VSS) DD48.T10(VSS) DD48.T11(VSS) DD48.T12(VSS) DD48.T13(VSS) DD48.T14(VSS) DD48.T15(VSS) DD48.T16(VSS) DD48.T17(VSS) DD48.T18(VSS) DD48.T21(VSS) DD48.T22(VSS) DD48.T25(VSS) DD48.U03(VSS) DD48.U09(VSS) DD48.U10(VSS) DD48.U11(VSS) DD48.U12(VSS) DD48.U13(VSS) DD48.U14(VSS) DD48.U15(VSS) DD48.U16(VSS) DD48.U17(VSS) DD48.U18(VSS) DD48.U21(VSS) DD48.U24(VSS) DD48.V05(VSS) DD48.V09(VSS) DD48.V10(VSS) DD48.V11(VSS) DD48.V12(VSS) DD48.V13(VSS) DD48.V14(VSS) DD48.V15(VSS) DD48.V16(VSS) DD48.V18(VSS) DD48.V22(VSS) DD48.W03(VSS) DD48.W21(VSS) DD48.W24(VSS) DD48.Y01(VSS) DD48.Y04(VSS) DD48.Y05(VSS) DD48.Y12(VSS) DD48.Y21(VSS) DD48.Y22(VSS) DD48.Y23(VSS) DD48.Y24(VSS) DD48.Y25(VSS) DD48.Y26(VSS)

### Notes on the sheet
- PP1_GND
- A3
- SIZE
- PROJECT
- SHEET
- OF
- Engineer: Oleg Serbinov
- (in symbol 98DX1035A1-BIH2C002, part O) GND

### Library data of the parts
DD48 = 98DX1035A1-BIH2C002: as DD39 on sheet 30_PP0_PWR; Manufacturer Part Number: 98DX1035B0-BIH2C002